# Altium project Jumperless_breadboard_REV1.PrjPcb (part 1 of 4)
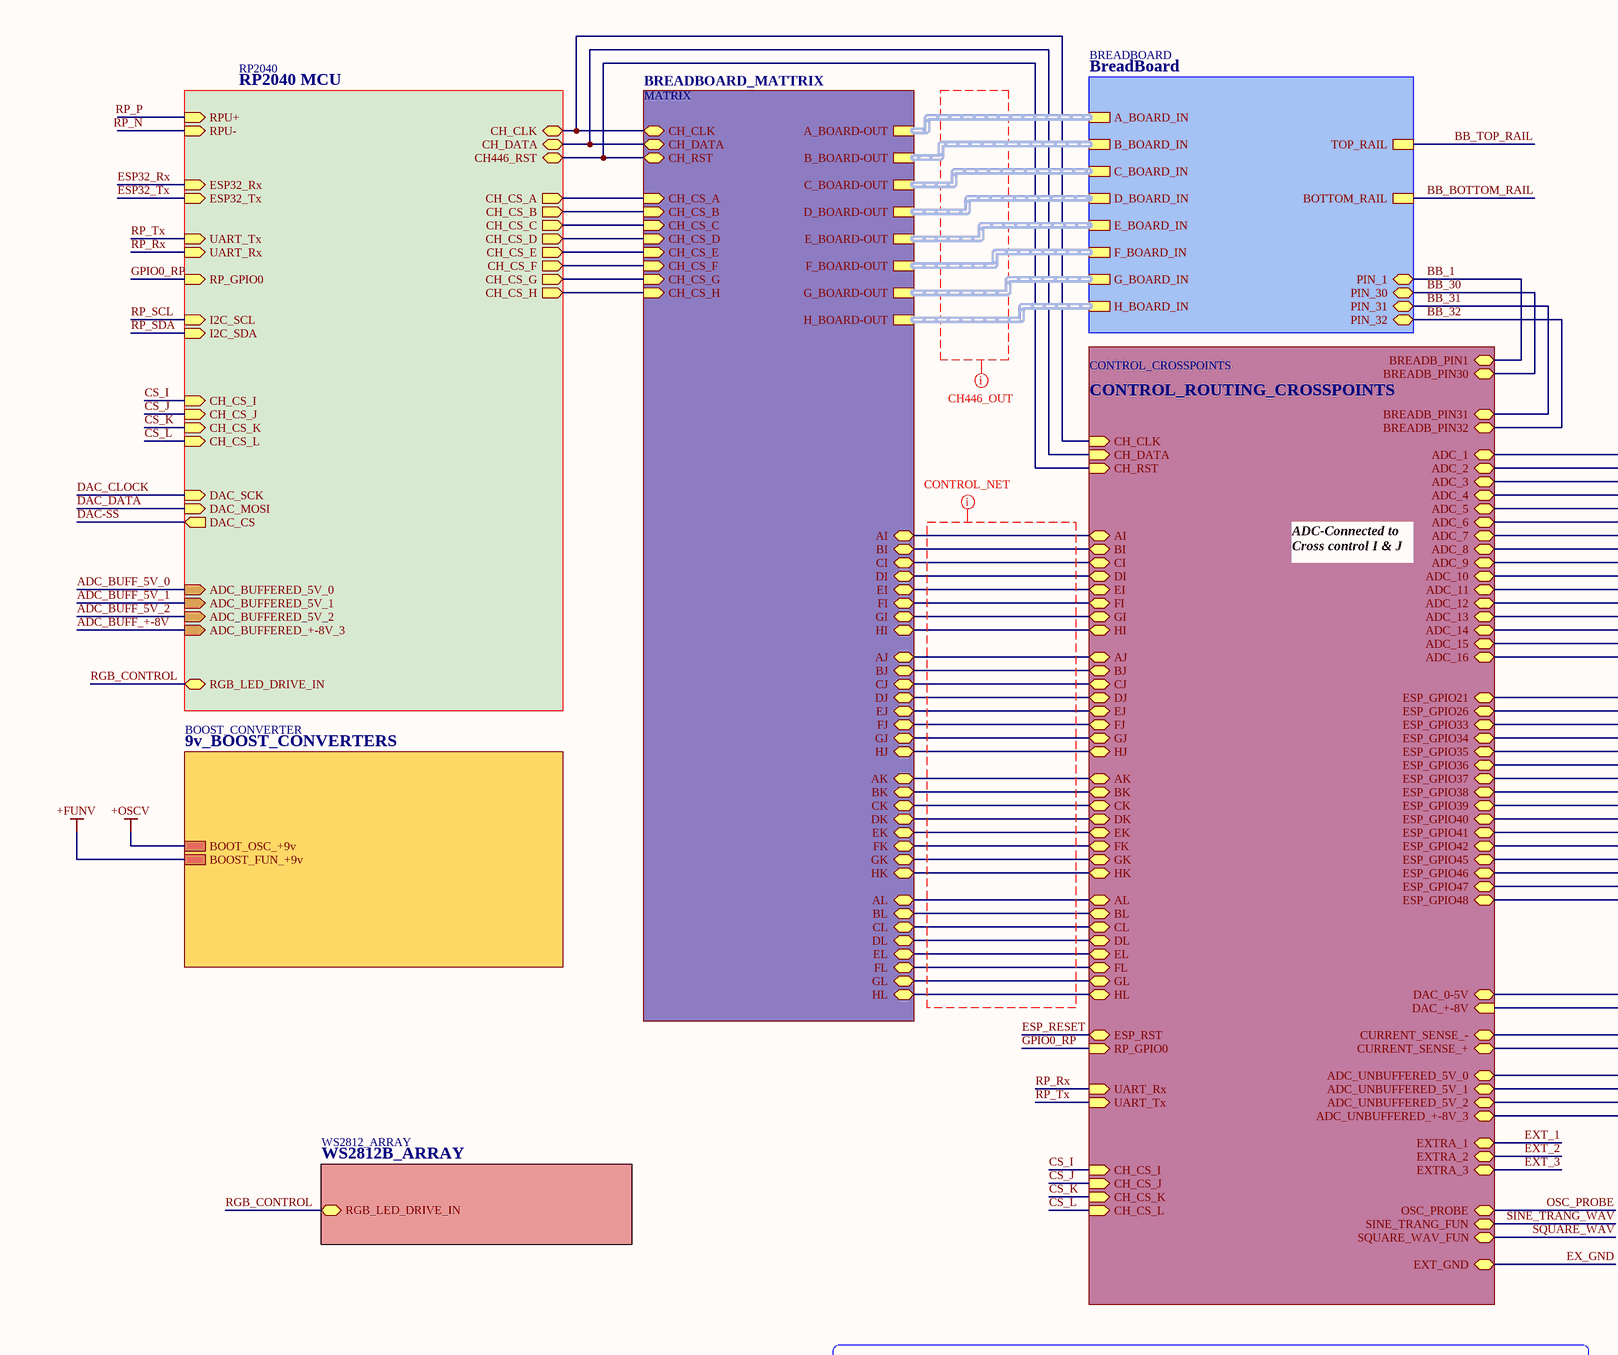
[diagram p0: Main.SchDoc, top left]
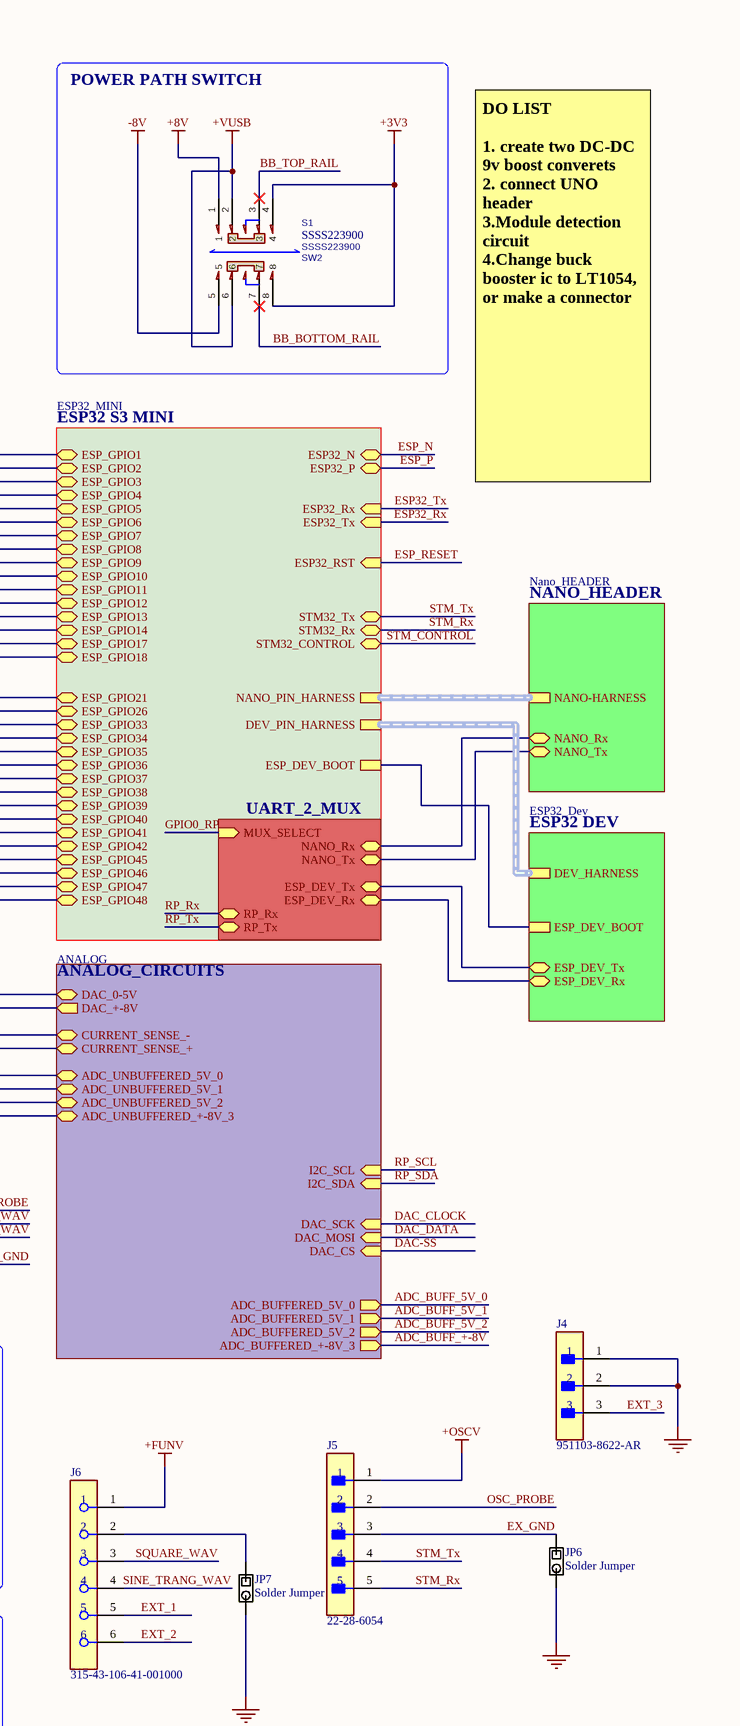
[diagram p1: Main.SchDoc, top right]
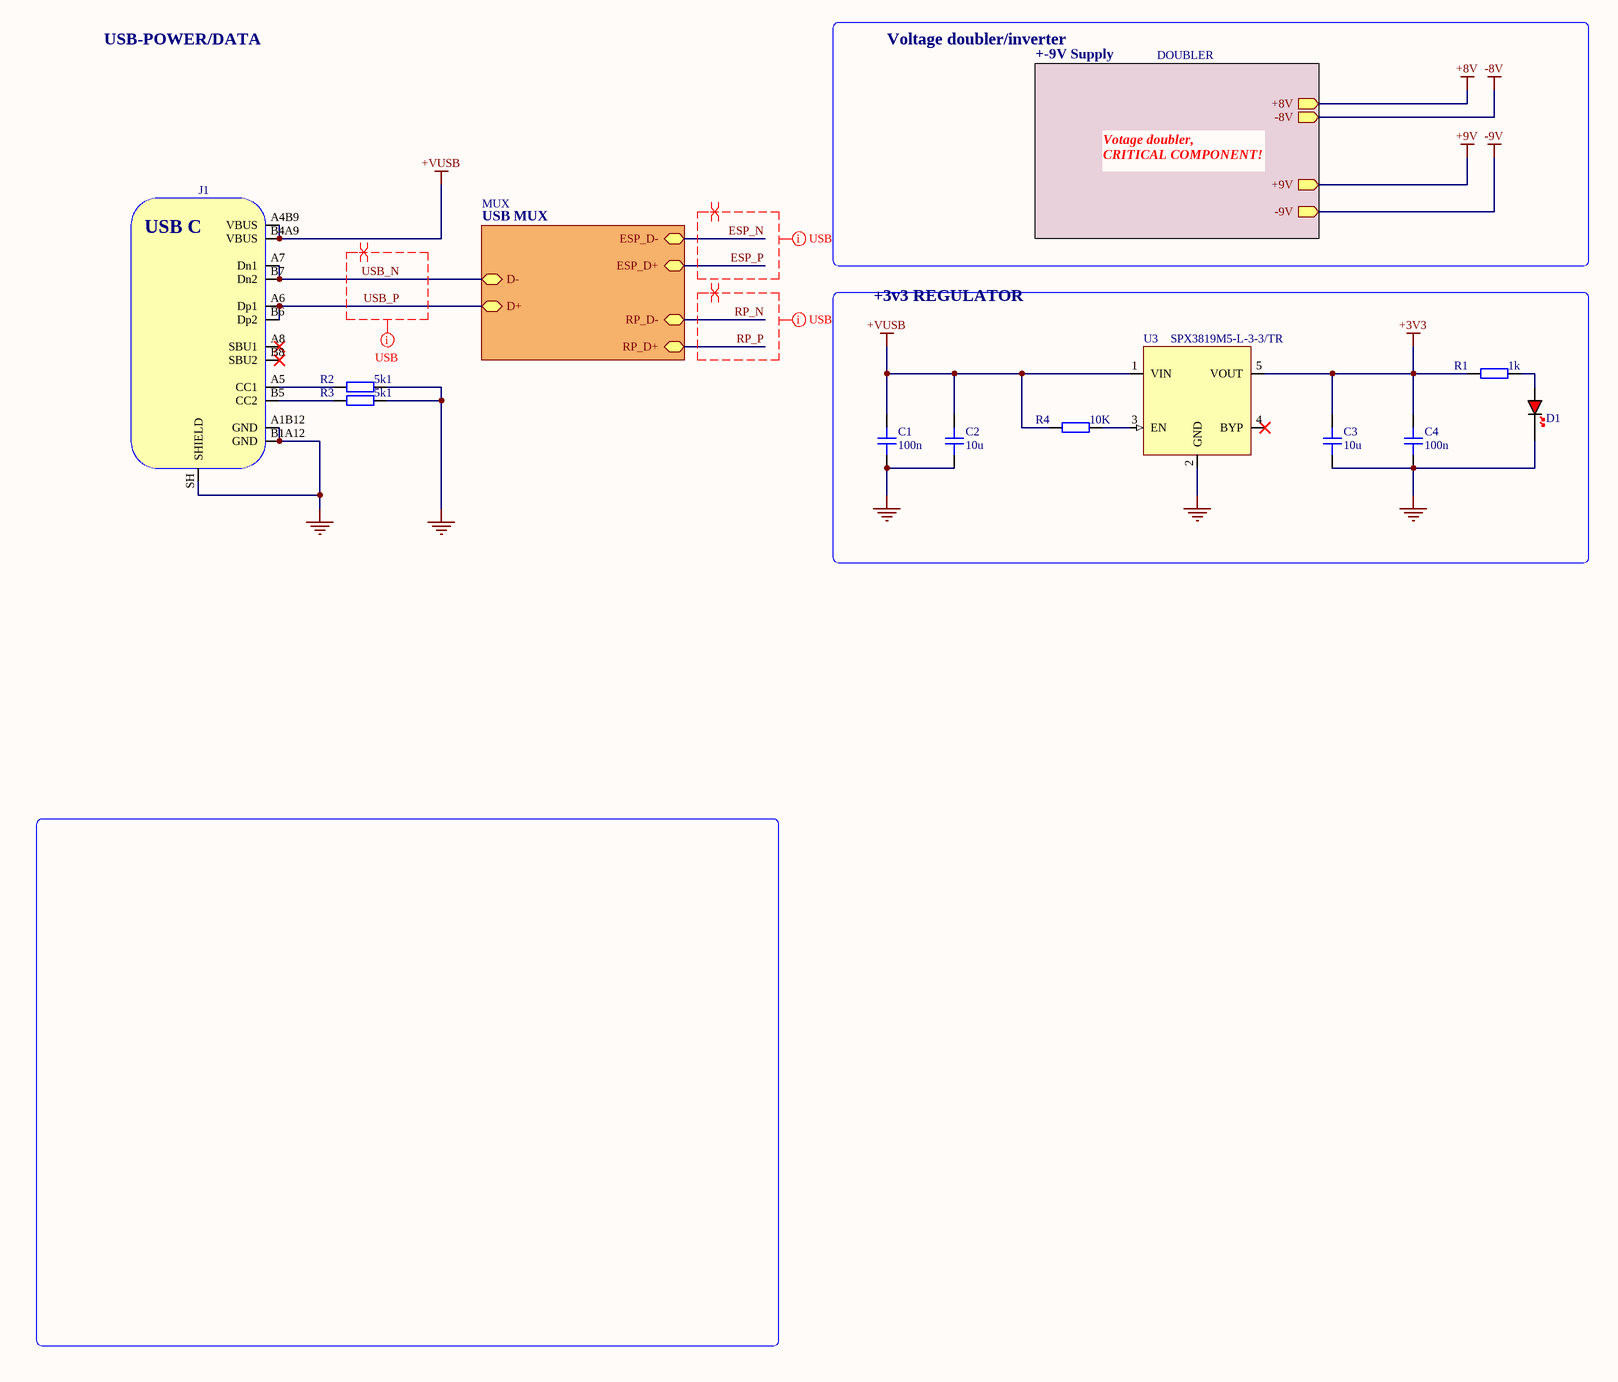
[diagram p2: Main.SchDoc, bottom left]
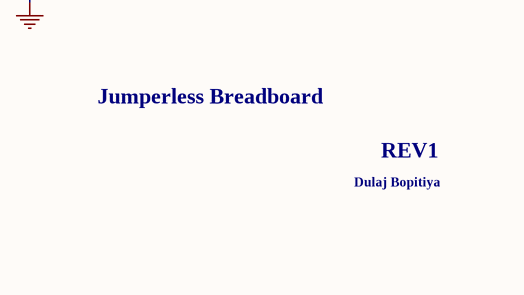
[diagram p3: Main.SchDoc, bottom right]
14 sheets, 615 parts. Net scope: hierarchical (ports join the sheet entries above them; power ports are global).
Board file: PCB1.PcbDoc
Sheets:
  Main.SchDoc
    MUX = USB MUX.SchDoc
    MATRIX = BREADBOARD_MATTRIX.SchDoc
    RP2040 = RP2040 MCU.SchDoc
    ESP32_MINI = ESP32 S3 MINI.SchDoc
    DOUBLER = +-9V Supply.SchDoc
    BREADBOARD = BreadBoard.SchDoc
    ANALOG = ANALOG_CIRCUITS.SchDoc
    CONTROL_CROSSPOINTS = CONTROL_ROUTING_CROSSPOINTS.SchDoc
    WS2812_ARRAY = WS2812B_ARRAY.SchDoc
    BOOST_CONVERTER = 9v_BOOST_CONVERTERS.SchDoc
    Nano_HEADER = NANO_HEADER.SchDoc
    ESP32_Dev = ESP32 DEV.SchDoc
    Designator = UART_2_MUX.SchDoc

## Sheet Main.SchDoc
size 430 x 369 mm; SheetNumber: 1; SheetTotal: 14

### Parts
C1  100n  [CAP_0805]
C2  10u  [CAP_0805]
C3  10u  [CAP_0805]
C4  100n  [CAP_0805]
D1  RED  [LED_0603_RED]  (value not drawn)
J1  B4105-GF-A-060  [USB4105-GF-A-060]  (value not drawn)
J4  951103-8622-AR  [FP-951103-8622-AR-MFG]
J5  22-28-6054  [FP-22-28-6054-MFG]
J6  315-43-106-41-001000  [FP-315-43-106-41-001000-MFG]
JP6  Solder Jumper  [SolderJumper_Single]
JP7  Solder Jumper  [SolderJumper_Single]
R1  1k  [RES_0603]
R2  5k1  [RES_0603]
R3  5k1  [RES_0603]
R4  10K  [RES_0603]
S1  SSSS223900  Reference: SW2  [SW-TH_SSSS223900]
U3  SPX3819M5-L-3-3/TR  [SOT-23-5]

### Blocks framed on the sheet
POWER PATH SWITCH: S1
+3v3 REGULATOR: C1-C4 D1 R1 R4 U3

### Sub-sheets
ANALOG = ANALOG_CIRCUITS: ADC_UNBUFFERED_5V_0 (bidir), ADC_BUFFERED_5V_0 (out), ADC_UNBUFFERED_5V_1 (bidir), ADC_BUFFERED_5V_1 (out), ADC_UNBUFFERED_5V_2 (bidir), ADC_BUFFERED_5V_2 (out), ADC_UNBUFFERED_+-8V_3 (bidir), ADC_BUFFERED_+-8V_3 (out), DAC_+-8V (out), DAC_MOSI (in), DAC_SCK (in), DAC_CS (in), I2C_SCL (in), I2C_SDA (in), CURRENT_SENSE_+ (bidir), CURRENT_SENSE_- (bidir), DAC_0-5V (bidir)
BOOST_CONVERTER = 9v_BOOST_CONVERTERS: BOOT_OSC_+9v, BOOST_FUN_+9v
BREADBOARD = BreadBoard: A_BOARD_IN (harness A_BOARD_H), B_BOARD_IN (harness B_BOARD_H), C_BOARD_IN (harness C_BOARD_H), D_BOARD_IN (harness D_BOARD_H), E_BOARD_IN (harness E_BOARD_H), F_BOARD_IN (harness F_BOARD_H), G_BOARD_IN (harness G_BOARD_H), H_BOARD_IN (harness H_BOARD_H), PIN_1 (bidir), PIN_31 (bidir), PIN_32 (bidir), PIN_30 (bidir), TOP_RAIL, BOTTOM_RAIL
CONTROL_CROSSPOINTS = CONTROL_ROUTING_CROSSPOINTS: CH_CLK (in), CH_DATA (in), CH_RST (in), AI (bidir), BI (bidir), CI (bidir), DI (bidir), EI (bidir), FI (bidir), GI (bidir), HI (bidir), AJ (bidir), BJ (bidir), CJ (bidir), DJ (bidir), EJ (bidir), FJ (bidir), GJ (bidir), HJ (bidir), AK (bidir), BK (bidir), CK (bidir), DK (bidir), EK (bidir), FK (bidir), GK (bidir), HK (bidir), AL (bidir), BL (bidir), CL (bidir), DL (bidir), EL (bidir), FL (bidir), GL (bidir), HL (bidir), CH_CS_I (in), CH_CS_J (in), CH_CS_K (in), CH_CS_L (in), ADC_1 (bidir), ADC_2 (bidir), ADC_3 (bidir), ADC_4 (bidir), ADC_5 (bidir), ADC_6 (bidir), ADC_7 (bidir), ADC_8 (bidir), ADC_9 (bidir), ADC_10 (bidir), ADC_11 (bidir), ADC_12 (bidir), ADC_13 (bidir), ADC_14 (bidir), ESP_GPIO21 (bidir), ESP_GPIO26 (bidir), ESP_GPIO33 (bidir), ESP_GPIO34 (bidir), ESP_GPIO35 (bidir), ESP_GPIO36 (bidir), ESP_GPIO37 (bidir), ESP_GPIO38 (bidir), ESP_GPIO39 (bidir), ESP_GPIO40 (bidir), ESP_GPIO48 (bidir), ESP_GPIO47 (bidir), ESP_GPIO41 (bidir), ESP_GPIO42 (bidir), ESP_GPIO45 (bidir), ESP_GPIO46 (bidir), ADC_15 (bidir), ADC_16 (bidir), DAC_0-5V (bidir), CURRENT_SENSE_- (bidir), CURRENT_SENSE_+ (bidir), ADC_UNBUFFERED_+-8V_3 (bidir), DAC_+-8V (in), ESP_RST (bidir), ADC_UNBUFFERED_5V_0 (bidir), ADC_UNBUFFERED_5V_1 (bidir), ADC_UNBUFFERED_5V_2 (bidir), BREADB_PIN1 (bidir), BREADB_PIN30 (bidir), BREADB_PIN32 (bidir), BREADB_PIN31 (bidir), RP_GPIO0 (in), UART_Rx (in), UART_Tx (in), OSC_PROBE (bidir), EXT_GND (bidir), SQUARE_WAV_FUN (bidir), SINE_TRANG_FUN (bidir), EXTRA_1 (bidir), EXTRA_2 (bidir), EXTRA_3 (bidir)
Designator = UART_2_MUX: MUX_SELECT (in), RP_Tx (bidir), RP_Rx (bidir), ESP_DEV_Rx (bidir), ESP_DEV_Tx (bidir), NANO_Rx (bidir), NANO_Tx (bidir)
DOUBLER = +-9V Supply: +9V (out), -9V (out), +8V (out), -8V (out)
ESP32_Dev = ESP32 DEV: ESP_DEV_BOOT, ESP_DEV_Tx (bidir), ESP_DEV_Rx (bidir), DEV_HARNESS (harness DEV_HARNESS)
ESP32_MINI = ESP32 S3 MINI: ESP32_N (bidir), ESP32_P (bidir), ESP32_Rx (in), ESP32_Tx (in), ESP_GPIO1 (bidir), ESP_GPIO2 (bidir), ESP_GPIO3 (bidir), ESP_GPIO4 (bidir), ESP_GPIO5 (bidir), ESP_GPIO6 (bidir), ESP_GPIO7 (bidir), ESP_GPIO8 (bidir), ESP_GPIO9 (bidir), ESP_GPIO10 (bidir), ESP_GPIO11 (bidir), ESP_GPIO12 (bidir), ESP_GPIO13 (bidir), ESP_GPIO14 (bidir), ESP_GPIO17 (bidir), ESP_GPIO18 (bidir), ESP_GPIO21 (bidir), ESP_GPIO26 (bidir), ESP_GPIO48 (bidir), ESP_GPIO47 (bidir), ESP_GPIO33 (bidir), ESP_GPIO34 (bidir), ESP_GPIO35 (bidir), ESP_GPIO36 (bidir), ESP_GPIO37 (bidir), ESP_GPIO38 (bidir), ESP_GPIO39 (bidir), ESP_GPIO40 (bidir), ESP_GPIO41 (bidir), ESP_GPIO42 (bidir), ESP_GPIO45 (bidir), ESP_GPIO46 (bidir), ESP32_RST (in), NANO_PIN_HARNESS (harness NANO-HARNESS), DEV_PIN_HARNESS (harness DEV_HARNESS), ESP_DEV_BOOT, STM32_Tx (bidir), STM32_Rx (bidir), STM32_CONTROL (bidir)
MATRIX = BREADBOARD_MATTRIX: B_BOARD-OUT (harness B_BOARD_H), C_BOARD-OUT (harness C_BOARD_H), D_BOARD-OUT (harness D_BOARD_H), E_BOARD-OUT (harness E_BOARD_H), F_BOARD-OUT (harness F_BOARD_H), G_BOARD-OUT (harness G_BOARD_H), H_BOARD-OUT (harness H_BOARD_H), A_BOARD-OUT (harness A_BOARD_H), AL (bidir), BL (bidir), CL (bidir), DL (bidir), EL (bidir), FL (bidir), GL (bidir), HL (bidir), CH_CLK (bidir), CH_DATA (bidir), CH_RST (bidir), CH_CS_A (in), CH_CS_B (in), CH_CS_C (in), CH_CS_D (in), CH_CS_E (in), CH_CS_F (in), CH_CS_G (in), CH_CS_H (in), AI (bidir), BI (bidir), CI (bidir), DI (bidir), EI (bidir), FI (bidir), GI (bidir), HI (bidir), AJ (bidir), BJ (bidir), CJ (bidir), DJ (bidir), EJ (bidir), FJ (bidir), GJ (bidir), HJ (bidir), AK (bidir), BK (bidir), CK (bidir), DK (bidir), EK (bidir), FK (bidir), GK (bidir), HK (bidir)
MUX = USB MUX: D+ (bidir), D- (bidir), ESP_D- (bidir), ESP_D+ (bidir), RP_D- (bidir), RP_D+ (bidir)
Nano_HEADER = NANO_HEADER: NANO-HARNESS (harness NANO-HARNESS), NANO_Rx (bidir), NANO_Tx (bidir)
RP2040 = RP2040 MCU: RPU+ (in), RPU- (in), DAC_MOSI (in), DAC_SCK (in), DAC_CS (out), I2C_SDA (in), I2C_SCL (in), ADC_BUFFERED_5V_0 (in), ADC_BUFFERED_5V_1 (in), ADC_BUFFERED_5V_2 (in), ADC_BUFFERED_+-8V_3 (in), ESP32_Rx (in), ESP32_Tx (in), UART_Rx (in), UART_Tx (in), CH_CS_A (out), CH_CS_B (out), CH_CS_C (out), CH_CS_D (out), CH_CS_E (out), CH_CS_F (out), CH_CS_G (out), CH_CS_H (out), CH_CLK (bidir), CH_DATA (bidir), RGB_LED_DRIVE_IN (bidir), CH446_RST (bidir), CH_CS_I (in), CH_CS_J (in), CH_CS_K (in), CH_CS_L (in), RP_GPIO0 (in)
WS2812_ARRAY = WS2812B_ARRAY: RGB_LED_DRIVE_IN (bidir)

### Nets
+3V3: C3.2 C4.2 R1.1 S1.4 S1.8 U3.5(VOUT)  [project net BUCK1_3v3]
+8V: S1.1 ; sheet DOUBLER/+8V
+FUNV: J6.1 ; sheet BOOST_CONVERTER/BOOST_FUN_+9v
+OSCV: J5.1 ; sheet BOOST_CONVERTER/BOOT_OSC_+9v
+VUSB: C1.2 C2.2 J1.A4B9(VBUS) J1.B4A9(VBUS) R4.1 S1.2 S1.6 U3.1(VIN)  [project net ANALOG_5V]
-8V: S1.5 ; sheet DOUBLER/-8V
GND: C1.1 C2.1 C3.1 C4.1 D1.K J1.A1B12(GND) J1.B1A12(GND) J1.SH(SHIELD) J4.1 J4.2 JP6.2 JP7.2 R2.2 R3.2 U3.2(GND)  [project net REF]
\: sheet ESP32_MINI/ESP_GPIO38, sheet CONTROL_CROSSPOINTS/ESP_GPIO38
A0: sheet ESP32_MINI/ESP_GPIO1, sheet CONTROL_CROSSPOINTS/ADC_1
A1: sheet ESP32_MINI/ESP_GPIO13, sheet CONTROL_CROSSPOINTS/ADC_13
A2: sheet ESP32_MINI/ESP_GPIO3, sheet CONTROL_CROSSPOINTS/ADC_3
A3: sheet ESP32_MINI/ESP_GPIO17, sheet CONTROL_CROSSPOINTS/ADC_15
A4: sheet ESP32_MINI/ESP_GPIO5, sheet CONTROL_CROSSPOINTS/ADC_5
A5: sheet ESP32_MINI/ESP_GPIO21, sheet CONTROL_CROSSPOINTS/ESP_GPIO21
A6: sheet ESP32_MINI/ESP_GPIO7, sheet CONTROL_CROSSPOINTS/ADC_7
A7: sheet ESP32_MINI/ESP_GPIO33, sheet CONTROL_CROSSPOINTS/ESP_GPIO33
ADC_BUFF_5V_0: sheet RP2040/ADC_BUFFERED_5V_0, sheet ANALOG/ADC_BUFFERED_5V_0
ADC_BUFF_5V_1: sheet RP2040/ADC_BUFFERED_5V_1, sheet ANALOG/ADC_BUFFERED_5V_1
ADC_BUFF_5V_2: sheet RP2040/ADC_BUFFERED_5V_2, sheet ANALOG/ADC_BUFFERED_5V_2
ADC_BUFF_+-8V: sheet RP2040/ADC_BUFFERED_+-8V_3, sheet ANALOG/ADC_BUFFERED_+-8V_3
AREF: sheet ESP32_MINI/ESP_GPIO37, sheet CONTROL_CROSSPOINTS/ESP_GPIO37
BB_1: sheet BREADBOARD/PIN_1, sheet CONTROL_CROSSPOINTS/BREADB_PIN1
BB_30: sheet BREADBOARD/PIN_30, sheet CONTROL_CROSSPOINTS/BREADB_PIN30
BB_31: sheet BREADBOARD/PIN_31, sheet CONTROL_CROSSPOINTS/BREADB_PIN31
BB_32: sheet BREADBOARD/PIN_32, sheet CONTROL_CROSSPOINTS/BREADB_PIN32
BB_BOTTOM_RAIL: S1.7 ; sheet BREADBOARD/BOTTOM_RAIL
BB_TOP_RAIL: S1.3 ; sheet BREADBOARD/TOP_RAIL
CH446_CLK: sheet MATRIX/CH_CLK, sheet RP2040/CH_CLK, sheet CONTROL_CROSSPOINTS/CH_CLK
CH446_CS_A: sheet MATRIX/CH_CS_A, sheet RP2040/CH_CS_A
CH446_CS_B: sheet MATRIX/CH_CS_B, sheet RP2040/CH_CS_B
CH446_CS_C: sheet MATRIX/CH_CS_C, sheet RP2040/CH_CS_C
CH446_CS_D: sheet MATRIX/CH_CS_D, sheet RP2040/CH_CS_D
CH446_CS_E: sheet MATRIX/CH_CS_E, sheet RP2040/CH_CS_E
CH446_CS_F: sheet MATRIX/CH_CS_F, sheet RP2040/CH_CS_F
CH446_CS_G: sheet MATRIX/CH_CS_G, sheet RP2040/CH_CS_G
CH446_CS_H: sheet MATRIX/CH_CS_H, sheet RP2040/CH_CS_H
CH446_DATA: sheet MATRIX/CH_DATA, sheet RP2040/CH_DATA, sheet CONTROL_CROSSPOINTS/CH_DATA
CH446_RESET: sheet MATRIX/CH_RST, sheet RP2040/CH446_RST, sheet CONTROL_CROSSPOINTS/CH_RST
CROSS_AI: sheet MATRIX/AI, sheet CONTROL_CROSSPOINTS/AI
CROSS_AJ: sheet MATRIX/AJ, sheet CONTROL_CROSSPOINTS/AJ
CROSS_AK: sheet MATRIX/AK, sheet CONTROL_CROSSPOINTS/AK
CROSS_AL: sheet MATRIX/AL, sheet CONTROL_CROSSPOINTS/AL
CROSS_BI: sheet MATRIX/BI, sheet CONTROL_CROSSPOINTS/BI
CROSS_BJ: sheet MATRIX/BJ, sheet CONTROL_CROSSPOINTS/BJ
CROSS_BK: sheet MATRIX/BK, sheet CONTROL_CROSSPOINTS/BK
CROSS_BL: sheet MATRIX/BL, sheet CONTROL_CROSSPOINTS/BL
CROSS_CI: sheet MATRIX/CI, sheet CONTROL_CROSSPOINTS/CI
CROSS_CJ: sheet MATRIX/CJ, sheet CONTROL_CROSSPOINTS/CJ
CROSS_CK: sheet MATRIX/CK, sheet CONTROL_CROSSPOINTS/CK
CROSS_CL: sheet MATRIX/CL, sheet CONTROL_CROSSPOINTS/CL
CROSS_DI: sheet MATRIX/DI, sheet CONTROL_CROSSPOINTS/DI
CROSS_DJ: sheet MATRIX/DJ, sheet CONTROL_CROSSPOINTS/DJ
CROSS_DK: sheet MATRIX/DK, sheet CONTROL_CROSSPOINTS/DK
CROSS_DL: sheet MATRIX/DL, sheet CONTROL_CROSSPOINTS/DL
CROSS_EI: sheet MATRIX/EI, sheet CONTROL_CROSSPOINTS/EI
CROSS_EJ: sheet MATRIX/EJ, sheet CONTROL_CROSSPOINTS/EJ
CROSS_EK: sheet MATRIX/EK, sheet CONTROL_CROSSPOINTS/EK
CROSS_EL: sheet MATRIX/EL, sheet CONTROL_CROSSPOINTS/EL
CROSS_FI: sheet MATRIX/FI, sheet CONTROL_CROSSPOINTS/FI
CROSS_FJ: sheet MATRIX/FJ, sheet CONTROL_CROSSPOINTS/FJ
CROSS_FK: sheet MATRIX/FK, sheet CONTROL_CROSSPOINTS/FK
CROSS_FL: sheet MATRIX/FL, sheet CONTROL_CROSSPOINTS/FL
CROSS_GI: sheet MATRIX/GI, sheet CONTROL_CROSSPOINTS/GI
CROSS_GJ: sheet MATRIX/GJ, sheet CONTROL_CROSSPOINTS/GJ
CROSS_GK: sheet MATRIX/GK, sheet CONTROL_CROSSPOINTS/GK
CROSS_GL: sheet MATRIX/GL, sheet CONTROL_CROSSPOINTS/GL
CROSS_HI: sheet MATRIX/HI, sheet CONTROL_CROSSPOINTS/HI
CROSS_HJ: sheet MATRIX/HJ, sheet CONTROL_CROSSPOINTS/HJ
CROSS_HK: sheet MATRIX/HK, sheet CONTROL_CROSSPOINTS/HK
CROSS_HL: sheet MATRIX/HL, sheet CONTROL_CROSSPOINTS/HL
CS_I: sheet RP2040/CH_CS_I, sheet CONTROL_CROSSPOINTS/CH_CS_I  [project net CH446_CS_I]
CS_J: sheet RP2040/CH_CS_J, sheet CONTROL_CROSSPOINTS/CH_CS_J  [project net CH446_CS_J]
CS_K: sheet RP2040/CH_CS_K, sheet CONTROL_CROSSPOINTS/CH_CS_K  [project net CH446_CS_K]
CS_L: sheet RP2040/CH_CS_L, sheet CONTROL_CROSSPOINTS/CH_CS_L  [project net CH446_CS_L]
CURR_SENSE_DAC_-: sheet ANALOG/DAC_0-5V, sheet CONTROL_CROSSPOINTS/DAC_0-5V
D0: sheet ESP32_MINI/ESP_GPIO12, sheet CONTROL_CROSSPOINTS/ADC_12, sheet Nano_HEADER/NANO_Rx, sheet Designator/NANO_Rx
D1: sheet ESP32_MINI/ESP_GPIO2, sheet CONTROL_CROSSPOINTS/ADC_2, sheet Nano_HEADER/NANO_Tx, sheet Designator/NANO_Tx
D2: sheet ESP32_MINI/ESP_GPIO14, sheet CONTROL_CROSSPOINTS/ADC_14
D3: sheet ESP32_MINI/ESP_GPIO4, sheet CONTROL_CROSSPOINTS/ADC_4
D4: sheet ESP32_MINI/ESP_GPIO18, sheet CONTROL_CROSSPOINTS/ADC_16
D5: sheet ESP32_MINI/ESP_GPIO6, sheet CONTROL_CROSSPOINTS/ADC_6
D6: sheet ESP32_MINI/ESP_GPIO26, sheet CONTROL_CROSSPOINTS/ESP_GPIO26
D7: sheet ESP32_MINI/ESP_GPIO8, sheet CONTROL_CROSSPOINTS/ADC_8
D8: sheet ESP32_MINI/ESP_GPIO34, sheet CONTROL_CROSSPOINTS/ESP_GPIO34
D9: sheet ESP32_MINI/ESP_GPIO10, sheet CONTROL_CROSSPOINTS/ADC_10
D10: sheet ESP32_MINI/ESP_GPIO35, sheet CONTROL_CROSSPOINTS/ESP_GPIO35
D11: sheet ESP32_MINI/ESP_GPIO9, sheet CONTROL_CROSSPOINTS/ADC_9
D12: sheet ESP32_MINI/ESP_GPIO36, sheet CONTROL_CROSSPOINTS/ESP_GPIO36
D13: sheet ESP32_MINI/ESP_GPIO11, sheet CONTROL_CROSSPOINTS/ADC_11
DAC-SS: sheet RP2040/DAC_CS, sheet ANALOG/DAC_CS
DAC_CLOCK: sheet RP2040/DAC_SCK, sheet ANALOG/DAC_SCK
DAC_DATA: sheet RP2040/DAC_MOSI, sheet ANALOG/DAC_MOSI
DEV_BOOT: sheet ESP32_MINI/ESP_GPIO47, sheet ESP32_MINI/ESP_DEV_BOOT, sheet CONTROL_CROSSPOINTS/ESP_GPIO47, sheet ESP32_Dev/ESP_DEV_BOOT
DEV_RESET: sheet ESP32_MINI/ESP_GPIO48, sheet CONTROL_CROSSPOINTS/ESP_GPIO48
ESP32_Rx: sheet RP2040/ESP32_Rx, sheet ESP32_MINI/ESP32_Tx
ESP32_Tx: sheet RP2040/ESP32_Tx, sheet ESP32_MINI/ESP32_Rx
ESP_N: sheet MUX/ESP_D-, sheet ESP32_MINI/ESP32_N
ESP_P: sheet MUX/ESP_D+, sheet ESP32_MINI/ESP32_P
ESP_RESET: sheet ESP32_MINI/ESP32_RST, sheet CONTROL_CROSSPOINTS/ESP_RST
EX_GND: J5.3 JP6.1 ; sheet CONTROL_CROSSPOINTS/EXT_GND
EXT_1: J6.5 ; sheet CONTROL_CROSSPOINTS/EXTRA_1
EXT_2: J6.6 ; sheet CONTROL_CROSSPOINTS/EXTRA_2
EXT_3: J4.3 ; sheet CONTROL_CROSSPOINTS/EXTRA_3
GPIO0_RP: sheet RP2040/RP_GPIO0, sheet CONTROL_CROSSPOINTS/RP_GPIO0, sheet Designator/MUX_SELECT
GPIO39: sheet ESP32_MINI/ESP_GPIO39, sheet CONTROL_CROSSPOINTS/ESP_GPIO39
GPIO40: sheet ESP32_MINI/ESP_GPIO40, sheet CONTROL_CROSSPOINTS/ESP_GPIO40
GPIO41: sheet ESP32_MINI/ESP_GPIO41, sheet CONTROL_CROSSPOINTS/ESP_GPIO41
OSC_PROBE: J5.2 ; sheet CONTROL_CROSSPOINTS/OSC_PROBE
RGB_CONTROL: sheet RP2040/RGB_LED_DRIVE_IN, sheet WS2812_ARRAY/RGB_LED_DRIVE_IN
RP_N: sheet MUX/RP_D-, sheet RP2040/RPU-
RP_P: sheet MUX/RP_D+, sheet RP2040/RPU+
RP_Rx: sheet RP2040/UART_Rx, sheet CONTROL_CROSSPOINTS/UART_Rx, sheet Designator/RP_Rx  [project net CROSS_Rx]
RP_SCL: sheet RP2040/I2C_SCL, sheet ANALOG/I2C_SCL  [project net CURRENT_SCL]
RP_SDA: sheet RP2040/I2C_SDA, sheet ANALOG/I2C_SDA  [project net CURRENT_SDA]
RP_Tx: sheet RP2040/UART_Tx, sheet CONTROL_CROSSPOINTS/UART_Tx, sheet Designator/RP_Tx  [project net CROSS_Tx]
SINE_TRANG_WAV: J6.4 ; sheet CONTROL_CROSSPOINTS/SINE_TRANG_FUN
SQUARE_WAV: J6.3 ; sheet CONTROL_CROSSPOINTS/SQUARE_WAV_FUN
STM_CONTROL: sheet ESP32_MINI/ESP_GPIO42, sheet ESP32_MINI/STM32_CONTROL, sheet CONTROL_CROSSPOINTS/ESP_GPIO42  [project net GPIO42]
STM_Rx: J5.5 ; sheet ESP32_MINI/ESP_GPIO45, sheet ESP32_MINI/STM32_Rx, sheet CONTROL_CROSSPOINTS/ESP_GPIO45  [project net GPIO45]
STM_Tx: J5.4 ; sheet ESP32_MINI/ESP_GPIO46, sheet ESP32_MINI/STM32_Tx, sheet CONTROL_CROSSPOINTS/ESP_GPIO46  [project net GPIO46]
USB_N: J1.A7(Dn1) J1.B7(Dn2) ; sheet MUX/D-
USB_P: J1.A6(Dp1) J1.B6(Dp2) ; sheet MUX/D+
Net*_8: sheet ESP32_Dev/ESP_DEV_Tx, sheet Designator/ESP_DEV_Tx
Net*_10: sheet ESP32_Dev/ESP_DEV_Rx, sheet Designator/ESP_DEV_Rx
NetC51_2: sheet ANALOG/DAC_+-8V, sheet CONTROL_CROSSPOINTS/DAC_+-8V
NetD1_A: D1.A R1.2
NetJ1_A5: J1.A5(CC1) R2.1
NetJ1_B5: J1.B5(CC2) R3.1
NetJ6_2: J6.2 JP7.1
NetR4_2: R4.2 U3.3(EN)
NetR18_1: sheet ANALOG/CURRENT_SENSE_-, sheet CONTROL_CROSSPOINTS/CURRENT_SENSE_-
NetR18_2: sheet ANALOG/CURRENT_SENSE_+, sheet CONTROL_CROSSPOINTS/CURRENT_SENSE_+
NetU18_3: sheet ANALOG/ADC_UNBUFFERED_5V_0, sheet CONTROL_CROSSPOINTS/ADC_UNBUFFERED_5V_0
NetU18_5: sheet ANALOG/ADC_UNBUFFERED_+-8V_3, sheet CONTROL_CROSSPOINTS/ADC_UNBUFFERED_+-8V_3
NetU18_10: sheet ANALOG/ADC_UNBUFFERED_5V_1, sheet CONTROL_CROSSPOINTS/ADC_UNBUFFERED_5V_1
NetU18_12: sheet ANALOG/ADC_UNBUFFERED_5V_2, sheet CONTROL_CROSSPOINTS/ADC_UNBUFFERED_5V_2

Not connected (* = marked no-connect by the designer): J1 A8(SBU1)* B8(SBU2)*; U3 4(BYP)*

### Buses and harness runs
harness sheet BREADBOARD/A_BOARD_IN = sheet MATRIX/A_BOARD-OUT
harness sheet BREADBOARD/B_BOARD_IN = sheet MATRIX/B_BOARD-OUT
harness sheet BREADBOARD/C_BOARD_IN = sheet MATRIX/C_BOARD-OUT
harness sheet BREADBOARD/D_BOARD_IN = sheet MATRIX/D_BOARD-OUT
harness sheet BREADBOARD/E_BOARD_IN = sheet MATRIX/E_BOARD-OUT
harness sheet BREADBOARD/F_BOARD_IN = sheet MATRIX/F_BOARD-OUT
harness sheet BREADBOARD/G_BOARD_IN = sheet MATRIX/G_BOARD-OUT
harness sheet BREADBOARD/H_BOARD_IN = sheet MATRIX/H_BOARD-OUT
harness sheet ESP32_Dev/DEV_HARNESS = sheet ESP32_MINI/DEV_PIN_HARNESS
harness sheet ESP32_MINI/NANO_PIN_HARNESS = sheet Nano_HEADER/NANO-HARNESS

### Layout directives
mark named CH446_OUT: (no net found under the mark)
differential pair: ESP_N, ESP_P, RP_N, RP_P, USB_N, USB_P
mark named USB: ESP_N, ESP_P, RP_N, RP_P, USB_N, USB_P
mark named CONTROL_NET: (no net found under the mark)

### Notes on the sheet
- DO LIST
  1. create two DC-DC 9v boost converets
  2. connect UNO header
  3.Module detection circuit
  4.Change buck booster ic to LT1054, or make a connector
- ADC-Connected to Cross control I & J
- USB-POWER/DATA
- Voltage doubler/inverter
- Votage doubler,
  CRITICAL COMPONENT!
- Jumperless Breadboard
- REV1
- Dulaj Bopitiya
- (in symbol USB4105-GF-A-060) USB C

### Library data of the parts
C1-C4 = CAP_0805: Capacitor SMD 0805; Manufacturer: *; Manufacturer Part Number: *; Distributor Link: *; LCSC: *; Rating: *; Dielectric: *
D1 = LED_0603_RED: LED 0603 RED SMD
J1 = USB4105-GF-A-060: USB Connector Type C SMT 12 Pin; Manufacturer: GCT; Manufacturer Part Number: USB4105-GF-A-060; Distributor Link: https://eu.mouser.com/ProductDetail/GCT/USB4105-GF-A-060?qs=QNEnbhJQKvY2mocwNJzgfA%3D%3D
J4 = CMP-05379-000003-1: CONN HEADER VERT 3POS 2MM; Manufacturer: 3M; Conn Gender: Male; Current Rating: 2A; Number Of Contacts: 3; Conn Orientation: Straight; Digikey Description: CONN HEADER VERT 3POS 2MM; Device Class L3: unset; Category: Conn; Height: 6.3mm; Manufacturer Part Number: 951103-8622-AR; RoHS: TRUE; Contact Material: Gold,Nickel; ComponentLink2Description: Datasheet; Temperature Range Low: -55°C; Device Class L1: Connectors; Pitch: 2mm; Mouser Description: Header; PinStrip; CopperAlloy; HighTempThermoplastic; 3Cnts; 1A; RtAngle; 951Series; Octopart: https://octopart.com/951103-8622-ar-3m-14400669; Package: 951103-8622-AR; Lead Free: Yes; Device Class L2: Headers and Wire Housings; Temperature Range High: +125°C; ComponentLink2URL: http://multimedia.3m.com/mws/media/1400506O/3m-pin-strip-header-951-series-78-5100-2653-3.pdf; Automotive: No; Temperature: -55°C to +125°C; Number Of Rows: 1
J5 = CMP-04776-001058-1: KK 100 HDR ASSY RA BKWY 05 CKT 3; Number of Positions: 5; Current Rating: 4A; Contact Resistance: 20mR; Gender: Male; Pitch: 2.54mm; Voltage Rating: 250V; Glow Wire Compliant: Non-compliant; Min Operating Temperature: 0°C; Number of Circuits: 5; Number of Rows: 1; Termination: Solder; Orientation: Right Angle; ELV: Compliant; Package Quantity: 1500; Contact Plating: Gold; RoHS Compliant: Yes; Max Operating Temperature: 75°C; Number of Contacts: 5; Mount: Through Hole; Packaging: Bulk; Series: 42376; Flammability Rating: UL94 V-0
J6 = CMP-00254-12081839-1: 315-43-106-41-001000 IC & Component Sockets Interconnect Socket; Number of Positions: 6; Pitch: 2.54mm; Connector Type: Receptacle, Socket; Contact Plating: Gold; NexarPartId: 12081839; Mount: Through Hole; RoHS: Compliant; Termination: Solder; Packaging: Bulk; Color: Black; Number of Rows: 1
JP6 JP7 = SolderJumper_Single: Solder Jumper Single 0.5mm Pitch
R1-R4 = RES_0603: Resistor SMD 0603; Manufacturer: *; Manufacturer Part Number: *; Distributor Link: *; LCSC: *
U3 = SPX3819M5-L-3-3/TR: 500mA +3.3V Low-Noise LDO Voltage Regulator; Manufacturer: MaxLinear; Manufacturer Part Number: SPX3819M5-L-3-3/TR
S1 = SSSS223900: Footprint: easyeda2kicad:SW-TH_SSSS223900; Datasheet: https://lcsc.com/product-detail/Toggle-Switches_ALPS_SSSS223900_SSSS223900_C160874.html; LCSC Part: C160874; Value: SSSS223900

## Sheet USB MUX.SchDoc
size A; SheetNumber: 2; SheetTotal: 14
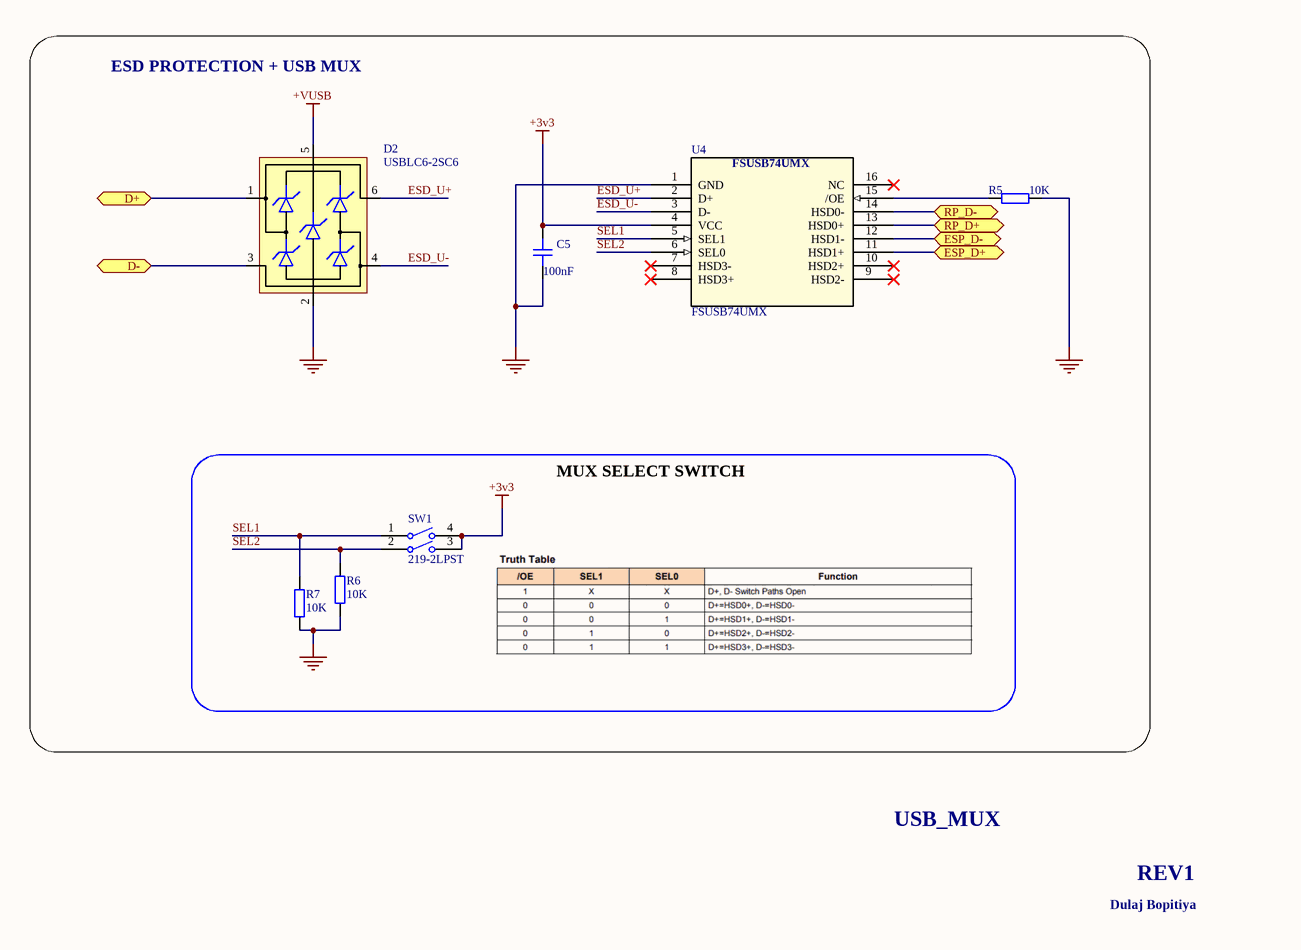
[diagram p4: USB MUX.SchDoc, left]

### Parts
C5  100nF  [CAP_0603]
D2  USBLC6-2SC6  [SOT-23-6]
R5  10K  [RES_0603]
R6  10K  [RES_0603]
R7  10K  [RES_0603]
SW1  219-2LPST  [CTS-219-2LPST_V]
U4  FSUSB74UMX  [UMLP16_1P8X2P6_ONS]

### Blocks framed on the sheet
ESD PROTECTION + USB MUX: C5 D2 R5 U4
MUX SELECT SWITCH: R6 R7 SW1

### Ports
D+ (bidir), D- (bidir), ESP_D+ (bidir), ESP_D- (bidir), RP_D+ (bidir), RP_D- (bidir)

### Nets
+3v3: C5.2 SW1.3 SW1.4 U4.4(VCC)  [project net BUCK1_3v3]
+VUSB: D2.5(VBUS)  [project net ANALOG_5V]
GND: C5.1 D2.2(GND) R5.1 R6.1 R7.1 U4.1(GND)  [project net REF]
ESD_U+: D2.6(IO1) U4.2(D+)  [project net ESD_U+_2]
ESD_U-: D2.4(IO2) U4.3(D-)  [project net ESD_U-_2]
ESP_N: U4.12(HSD1-) ; port ESP_D-
ESP_P: U4.11(HSD1+) ; port ESP_D+
RP_N: U4.14(HSD0-) ; port RP_D-
RP_P: U4.13(HSD0+) ; port RP_D+
SEL1: R7.2 SW1.1 U4.5(SEL1)  [project net SEL1_2]
SEL2: R6.2 SW1.2 U4.6(SEL0)  [project net SEL2_2]
USB_N: D2.3(IO2) ; port D-
USB_P: D2.1(IO1) ; port D+
NetR5_2: R5.2 U4.15(/OE)

Not connected (* = marked no-connect by the designer): U4 7(HSD3-)* 8(HSD3+)* 9(HSD2-)* 10(HSD2+)* 16(NC)*

### Notes on the sheet
- USB_MUX
- REV1
- Dulaj Bopitiya

### Library data of the parts
C5 = CAP_0603: Capacitor SMD 0603; Manufacturer: *; Manufacturer Part Number: *; Distributor Link: *; LCSC: *; Rating: *; Dielectric: *
D2 = USBLC6-2SC6: Low-Capacitance ESD Protection USB; Manufacturer: STMicroelectronics; Manufacturer Part Number: USBLC6-2SC6; Distributor Link: https://www.mouser.de/ProductDetail/STMicroelectronics/USBLC6-2SC6?qs=po45yt2pPpu%2FhNIlwQdTlg%3D%3D
R5-R7 = RES_0603: Resistor SMD 0603; Manufacturer: *; Manufacturer Part Number: *; Distributor Link: *; LCSC: *
SW1 = CMP-2000-05532-1: Surface Mount DIP Switch Auto Placeable, -55 to 85 degC, 4-Pin SMD, RoHS, Tube; Manufacturer: CTS Corporation; Sealed Option: Sealed; Circuitry: SPST; No of Positions: 2; Actuator Style: LowProfile; Type: Dip; Package Reference: 219-2LPST; Mounting Technology: SurfaceMount; Datasheet Version: 12/2008; Package Description: 4-Pin Surface Mount Device, Body 6.7 x 6.55 mm; Datasheet URL: http://www.ctscorp.com/wp-content/uploads/2016/01/219-Dec-30-2008.pdf; Termination Style: GullWing; Manufacturer URL: http://www.ctscorp.com/
U4 = FSUSB74UMX: No Description Available; Manufacturer_Name: onsemi; Copyright: Copyright (C) 2025 Ultra Librarian. All rights reserved.; Manufacturer_Part_Number: FSUSB74UMX; RefDes: RefDes; Type: Type

## Sheet BREADBOARD_MATTRIX.SchDoc
size A2; SheetNumber: 3; SheetTotal: 15
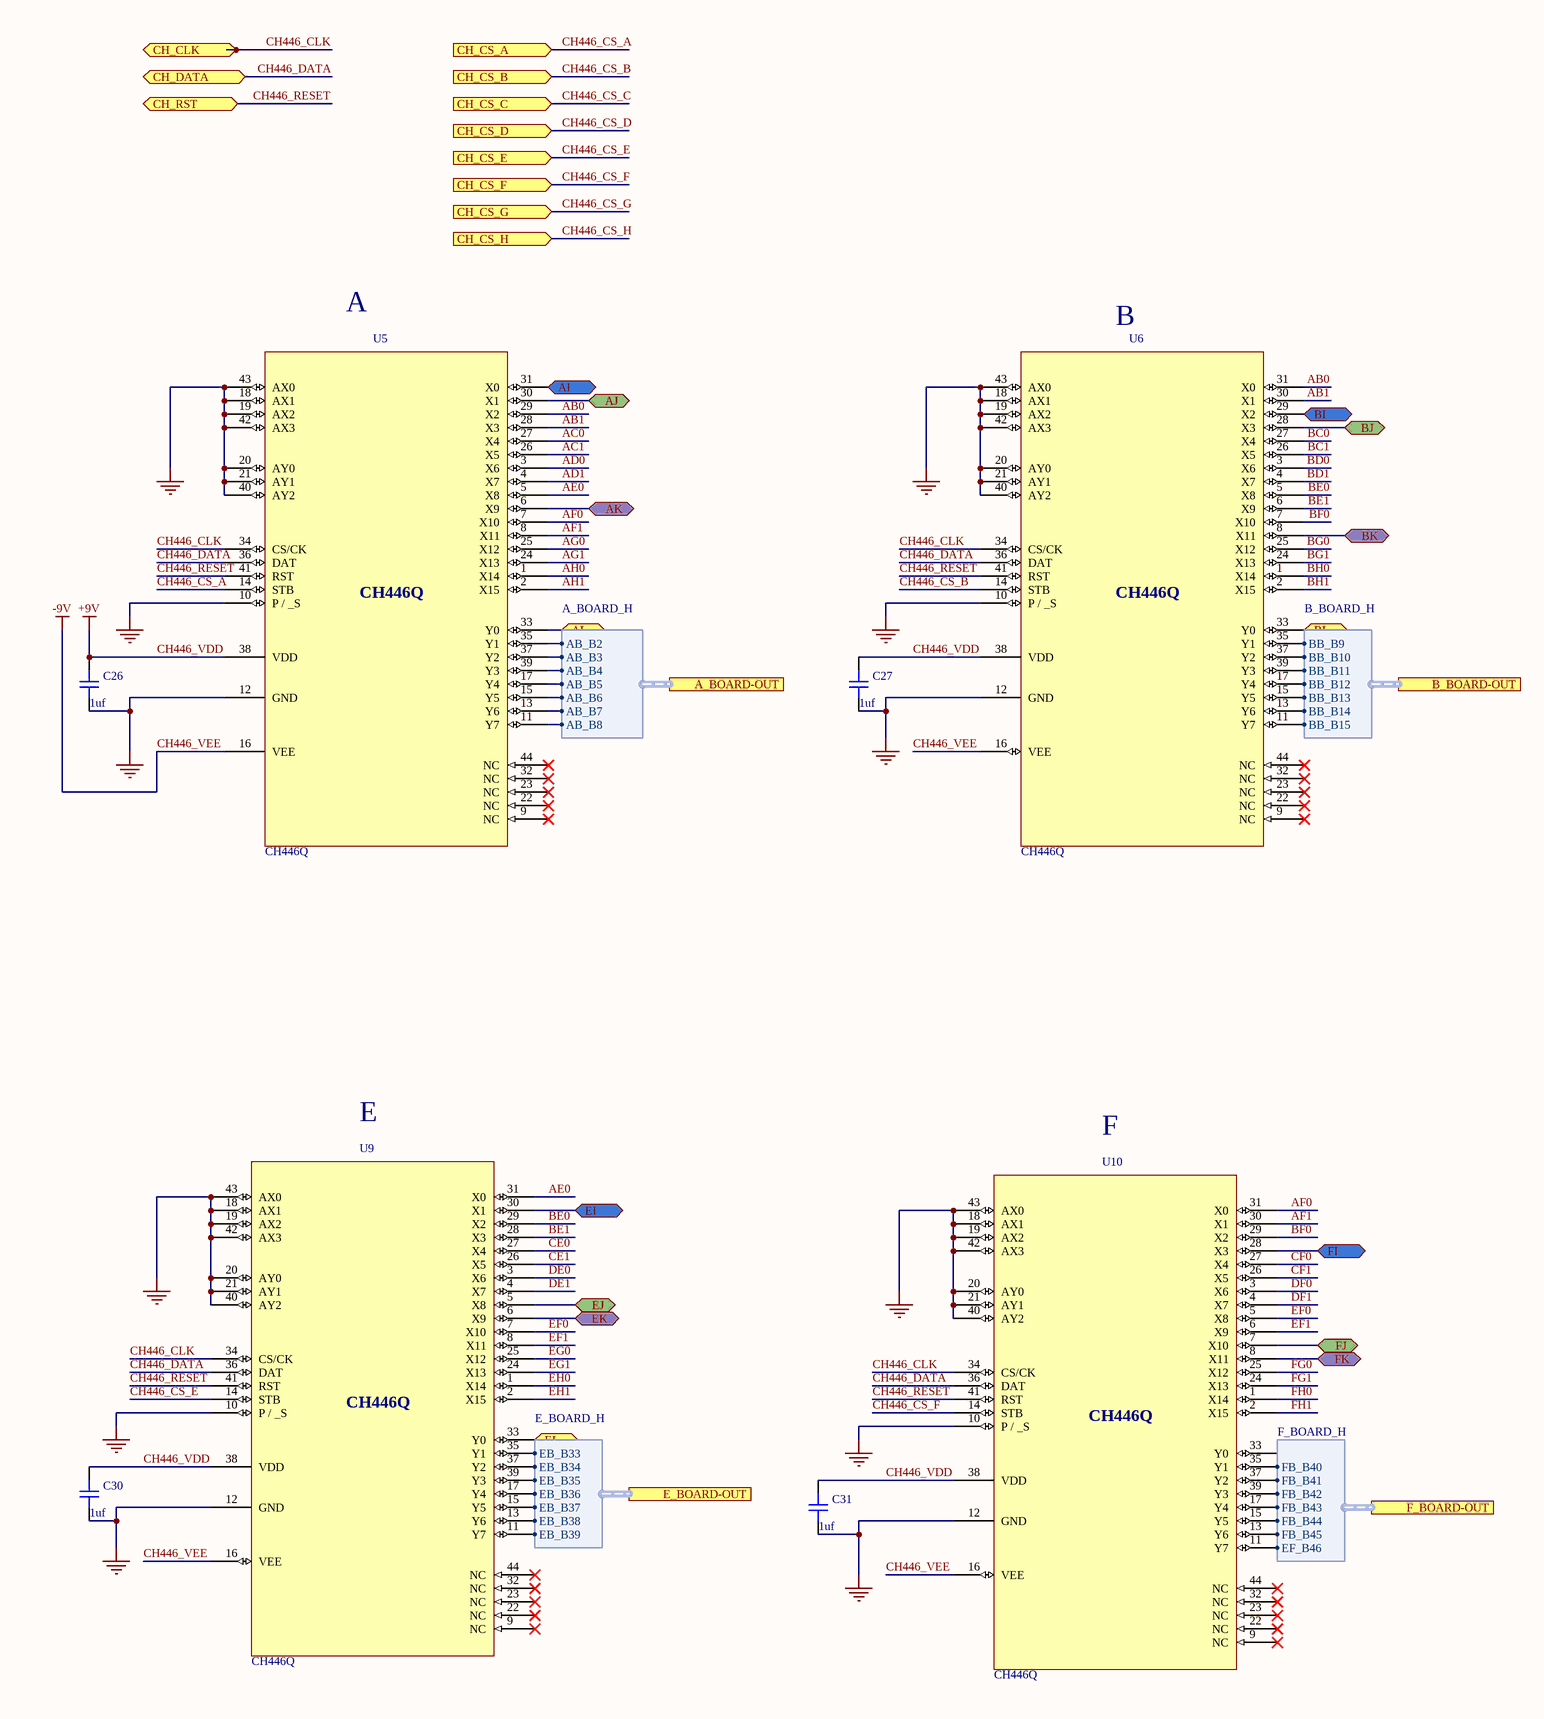
[diagram p5: BREADBOARD_MATTRIX.SchDoc, left]
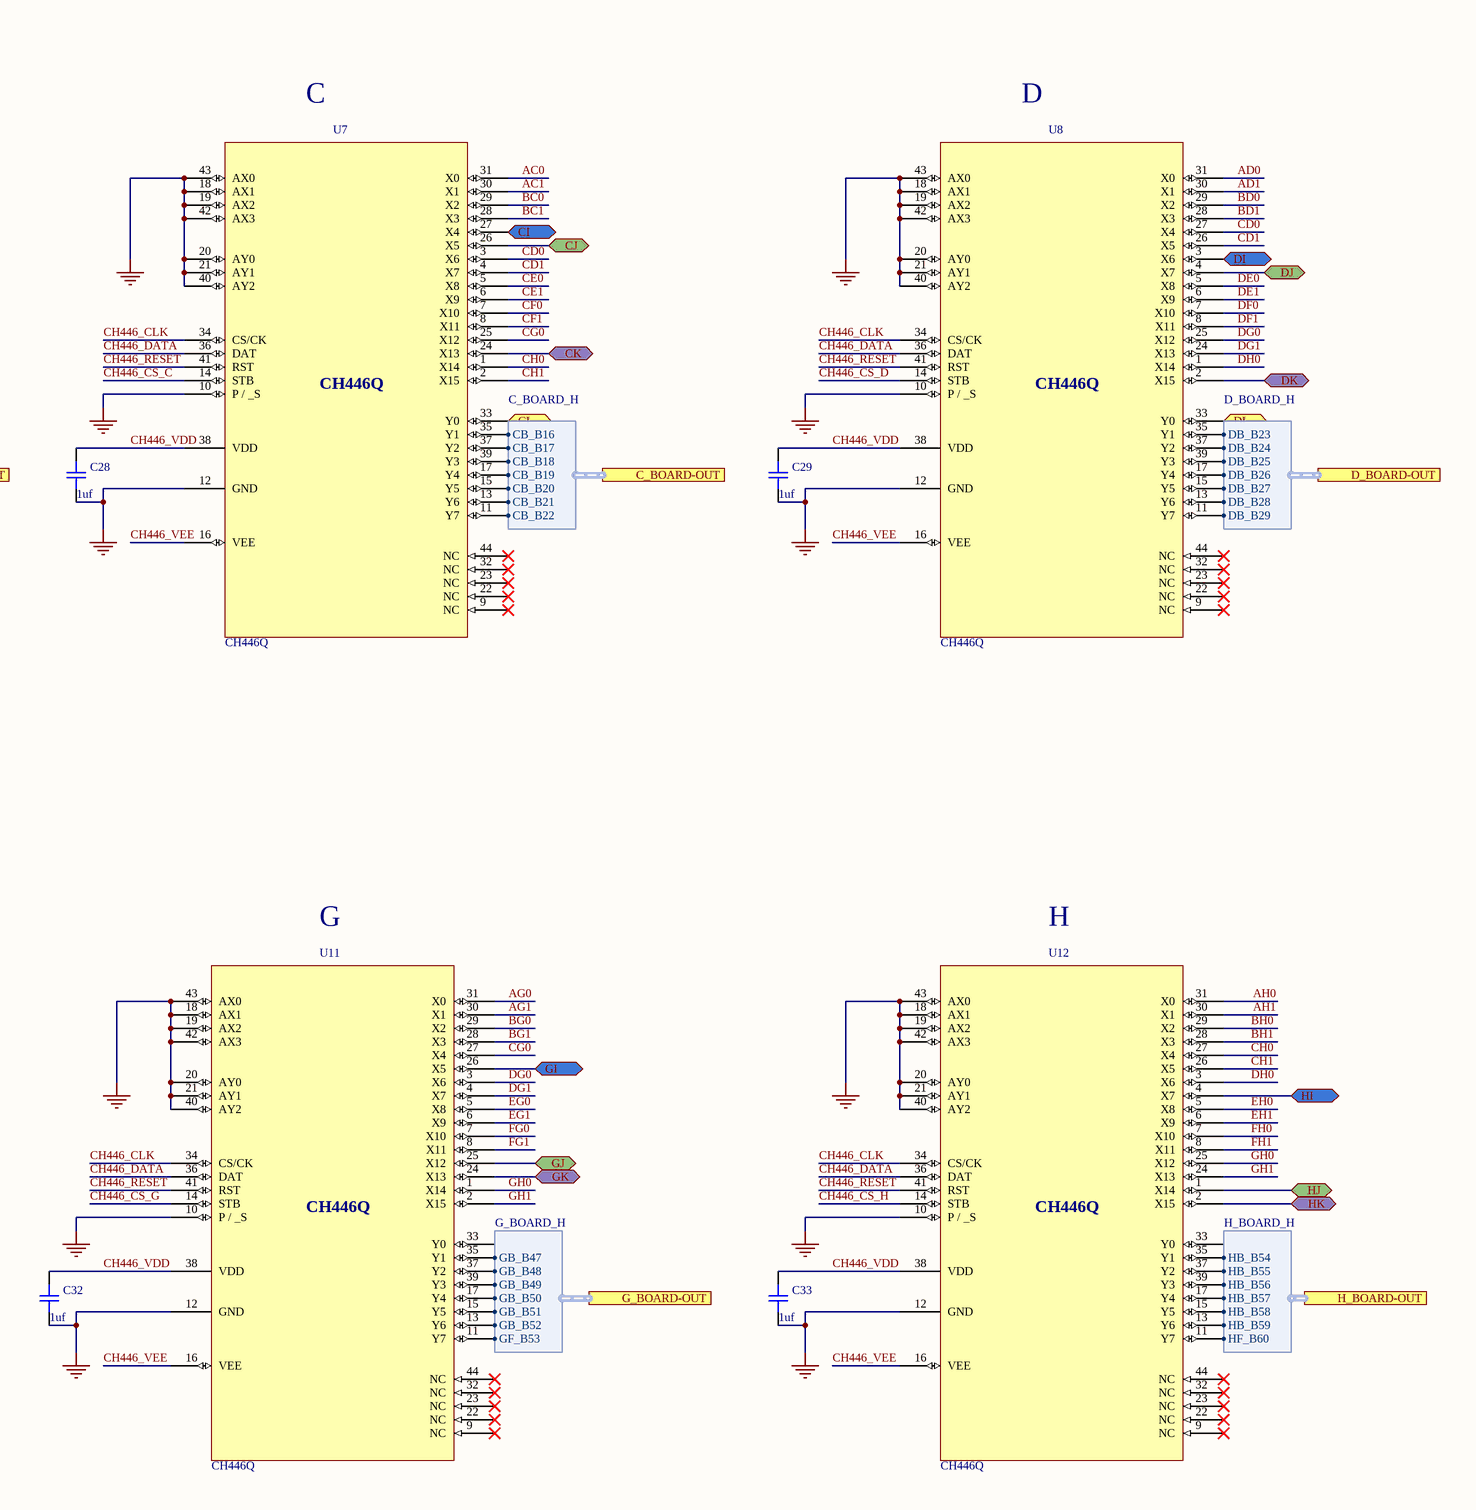
[diagram p6: BREADBOARD_MATTRIX.SchDoc, right]

### Parts
C26  1uf  [CAP_0603]
C27  1uf  [CAP_0603]
C28  1uf  [CAP_0603]
C29  1uf  [CAP_0603]
C30  1uf  [CAP_0603]
C31  1uf  [CAP_0603]
C32  1uf  [CAP_0603]
C33  1uf  [CAP_0603]
U5  CH446Q  [PG-LQFP-44]
U6  CH446Q  [PG-LQFP-44]
U7  CH446Q  [PG-LQFP-44]
U8  CH446Q  [PG-LQFP-44]
U9  CH446Q  [PG-LQFP-44]
U10  CH446Q  [PG-LQFP-44]
U11  CH446Q  [PG-LQFP-44]
U12  CH446Q  [PG-LQFP-44]

### Ports
A_BOARD-OUT (harness A_BOARD_H), AI (bidir), AJ (bidir), AK (bidir), AL (bidir), B_BOARD-OUT (harness B_BOARD_H), BI (bidir), BJ (bidir), BK (bidir), BL (bidir), C_BOARD-OUT (harness C_BOARD_H), CH_CLK (bidir), CH_CS_A (in), CH_CS_B (in), CH_CS_C (in), CH_CS_D (in), CH_CS_E (in), CH_CS_F (in), CH_CS_G (in), CH_CS_H (in), CH_DATA (bidir), CH_RST (bidir), CI (bidir), CJ (bidir), CK (bidir), CL (bidir), D_BOARD-OUT (harness D_BOARD_H), DI (bidir), DJ (bidir), DK (bidir), DL (bidir), E_BOARD-OUT (harness E_BOARD_H), EI (bidir), EJ (bidir), EK (bidir), EL (bidir), F_BOARD-OUT (harness F_BOARD_H), FI (bidir), FJ (bidir), FK (bidir), FL (bidir), G_BOARD-OUT (harness G_BOARD_H), GI (bidir), GJ (bidir), GK (bidir), GL (bidir), H_BOARD-OUT (harness H_BOARD_H), HI (bidir), HJ (bidir), HK (bidir), HL (bidir)

### Harnesses
A_BOARD_H: AB_B2, AB_B3, AB_B4, AB_B5, AB_B6, AB_B7, AB_B8
B_BOARD_H: BB_B9, BB_B10, BB_B11, BB_B12, BB_B13, BB_B14, BB_B15
C_BOARD_H: CB_B16, CB_B17, CB_B18, CB_B19, CB_B20, CB_B21, CB_B22
D_BOARD_H: DB_B23, DB_B24, DB_B25, DB_B26, DB_B27, DB_B28, DB_B29
E_BOARD_H: EB_B33, EB_B34, EB_B35, EB_B36, EB_B37, EB_B38, EB_B39
F_BOARD_H: FB_B40, FB_B41, FB_B42, FB_B43, FB_B44, FB_B45, EF_B46
G_BOARD_H: GB_B47, GB_B48, GB_B49, GB_B50, GB_B51, GB_B52, GF_B53
H_BOARD_H: HB_B54, HB_B55, HB_B56, HB_B57, HB_B58, HB_B59, HF_B60

### Nets
CH446_VDD: C26.2 C27.2 C28.2 C29.2 C30.2 C31.2 C32.2 C33.2 U5.38(VDD) U6.38(VDD) U7.38(VDD) U8.38(VDD) U9.38(VDD) U10.38(VDD) U11.38(VDD) U12.38(VDD)  [also labelled +9V]
CH446_VEE: U5.16(VEE) U6.16(VEE) U7.16(VEE) U8.16(VEE) U9.16(VEE) U10.16(VEE) U11.16(VEE) U12.16(VEE)  [also labelled -9V]
GND: C26.1 C27.1 C28.1 C29.1 C30.1 C31.1 C32.1 C33.1 U5.10(P_/__S) U5.12(GND) U5.18(AX1) U5.19(AX2) U5.20(AY0) U5.21(AY1) U5.40(AY2) U5.42(AX3) U5.43(AX0) U6.10(P_/__S) U6.12(GND) U6.18(AX1) U6.19(AX2) U6.20(AY0) U6.21(AY1) U6.40(AY2) U6.42(AX3) U6.43(AX0) U7.10(P_/__S) U7.12(GND) U7.18(AX1) U7.19(AX2) U7.20(AY0) U7.21(AY1) U7.40(AY2) U7.42(AX3) U7.43(AX0) U8.10(P_/__S) U8.12(GND) U8.18(AX1) U8.19(AX2) U8.20(AY0) U8.21(AY1) U8.40(AY2) U8.42(AX3) U8.43(AX0) U9.10(P_/__S) U9.12(GND) U9.18(AX1) U9.19(AX2) U9.20(AY0) U9.21(AY1) U9.40(AY2) U9.42(AX3) U9.43(AX0) U10.10(P_/__S) U10.12(GND) U10.18(AX1) U10.19(AX2) U10.20(AY0) U10.21(AY1) U10.40(AY2) U10.42(AX3) U10.43(AX0) U11.10(P_/__S) U11.12(GND) U11.18(AX1) U11.19(AX2) U11.20(AY0) U11.21(AY1) U11.40(AY2) U11.42(AX3) U11.43(AX0) U12.10(P_/__S) U12.12(GND) U12.18(AX1) U12.19(AX2) U12.20(AY0) U12.21(AY1) U12.40(AY2) U12.42(AX3) U12.43(AX0)  [project net REF]
AB0: U5.29(X2) U6.31(X0)  [project net AB0_3]
AB1: U5.28(X3) U6.30(X1)  [project net AB1_3]
AC0: U5.27(X4) U7.31(X0)  [project net AC0_3]
AC1: U5.26(X5) U7.30(X1)  [project net AC1_3]
AD0: U5.3(X6) U8.31(X0)  [project net AD0_3]
AD1: U5.4(X7) U8.30(X1)  [project net AD1_3]
AE0: U5.5(X8) U9.31(X0)  [project net AE0_3]
AF0: U5.7(X10) U10.31(X0)  [project net AF0_3]
AF1: U5.8(X11) U10.30(X1)  [project net AF1_3]
AG0: U5.25(X12) U11.31(X0)  [project net AG0_3]
AG1: U5.24(X13) U11.30(X1)  [project net AG1_3]
AH0: U5.1(X14) U12.31(X0)  [project net AH0_3]
AH1: U5.2(X15) U12.30(X1)  [project net AH1_3]
B_B2: U5.35(Y1) ; port A_BOARD-OUT.AB_B2
B_B3: U5.37(Y2) ; port A_BOARD-OUT.AB_B3
B_B4: U5.39(Y3) ; port A_BOARD-OUT.AB_B4
B_B5: U5.17(Y4) ; port A_BOARD-OUT.AB_B5
B_B6: U5.15(Y5) ; port A_BOARD-OUT.AB_B6
B_B7: U5.13(Y6) ; port A_BOARD-OUT.AB_B7
B_B8: U5.11(Y7) ; port A_BOARD-OUT.AB_B8
B_B9: U6.35(Y1) ; port B_BOARD-OUT.BB_B9
B_B10: U6.37(Y2) ; port B_BOARD-OUT.BB_B10
B_B11: U6.39(Y3) ; port B_BOARD-OUT.BB_B11
B_B12: U6.17(Y4) ; port B_BOARD-OUT.BB_B12
B_B13: U6.15(Y5) ; port B_BOARD-OUT.BB_B13
B_B14: U6.13(Y6) ; port B_BOARD-OUT.BB_B14
B_B15: U6.11(Y7) ; port B_BOARD-OUT.BB_B15
B_B16: U7.35(Y1) ; port C_BOARD-OUT.CB_B16
B_B17: U7.37(Y2) ; port C_BOARD-OUT.CB_B17
B_B18: U7.39(Y3) ; port C_BOARD-OUT.CB_B18
B_B19: U7.17(Y4) ; port C_BOARD-OUT.CB_B19
B_B20: U7.15(Y5) ; port C_BOARD-OUT.CB_B20
B_B21: U7.13(Y6) ; port C_BOARD-OUT.CB_B21
B_B22: U7.11(Y7) ; port C_BOARD-OUT.CB_B22
B_B23: U8.35(Y1) ; port D_BOARD-OUT.DB_B23
B_B24: U8.37(Y2) ; port D_BOARD-OUT.DB_B24
B_B25: U8.39(Y3) ; port D_BOARD-OUT.DB_B25
B_B26: U8.17(Y4) ; port D_BOARD-OUT.DB_B26
B_B27: U8.15(Y5) ; port D_BOARD-OUT.DB_B27
B_B28: U8.13(Y6) ; port D_BOARD-OUT.DB_B28
B_B29: U8.11(Y7) ; port D_BOARD-OUT.DB_B29
B_B33: U9.35(Y1) ; port E_BOARD-OUT.EB_B33
B_B34: U9.37(Y2) ; port E_BOARD-OUT.EB_B34
B_B35: U9.39(Y3) ; port E_BOARD-OUT.EB_B35
B_B36: U9.17(Y4) ; port E_BOARD-OUT.EB_B36
B_B37: U9.15(Y5) ; port E_BOARD-OUT.EB_B37
B_B38: U9.13(Y6) ; port E_BOARD-OUT.EB_B38
B_B39: U9.11(Y7) ; port E_BOARD-OUT.EB_B39
B_B40: U10.35(Y1) ; port F_BOARD-OUT.FB_B40
B_B41: U10.37(Y2) ; port F_BOARD-OUT.FB_B41
B_B42: U10.39(Y3) ; port F_BOARD-OUT.FB_B42
B_B43: U10.17(Y4) ; port F_BOARD-OUT.FB_B43
B_B44: U10.15(Y5) ; port F_BOARD-OUT.FB_B44
B_B45: U10.13(Y6) ; port F_BOARD-OUT.FB_B45
B_B46: U10.11(Y7) ; port F_BOARD-OUT.EF_B46
B_B47: U11.35(Y1) ; port G_BOARD-OUT.GB_B47
B_B48: U11.37(Y2) ; port G_BOARD-OUT.GB_B48
B_B49: U11.39(Y3) ; port G_BOARD-OUT.GB_B49
B_B50: U11.17(Y4) ; port G_BOARD-OUT.GB_B50
B_B51: U11.15(Y5) ; port G_BOARD-OUT.GB_B51
B_B52: U11.13(Y6) ; port G_BOARD-OUT.GB_B52
B_B53: U11.11(Y7) ; port G_BOARD-OUT.GF_B53
B_B54: U12.35(Y1) ; port H_BOARD-OUT.HB_B54
B_B55: U12.37(Y2) ; port H_BOARD-OUT.HB_B55
B_B56: U12.39(Y3) ; port H_BOARD-OUT.HB_B56
B_B57: U12.17(Y4) ; port H_BOARD-OUT.HB_B57
B_B58: U12.15(Y5) ; port H_BOARD-OUT.HB_B58
B_B59: U12.13(Y6) ; port H_BOARD-OUT.HB_B59
B_B60: U12.11(Y7) ; port H_BOARD-OUT.HF_B60
BC0: U6.27(X4) U7.29(X2)  [project net BC0_3]
BC1: U6.26(X5) U7.28(X3)  [project net BC1_3]
BD0: U6.3(X6) U8.29(X2)  [project net BD0_3]
BD1: U6.4(X7) U8.28(X3)  [project net BD1_3]
BE0: U6.5(X8) U9.29(X2)  [project net BE0_3]
BE1: U6.6(X9) U9.28(X3)  [project net BE1_3]
BF0: U6.7(X10) U10.29(X2)  [project net BF0_3]
BG0: U6.25(X12) U11.29(X2)  [project net BG0_3]
BG1: U6.24(X13) U11.28(X3)  [project net BG1_3]
BH0: U6.1(X14) U12.29(X2)  [project net BH0_3]
BH1: U6.2(X15) U12.28(X3)  [project net BH1_3]
CD0: U7.3(X6) U8.27(X4)  [project net CD0_3]
CD1: U7.4(X7) U8.26(X5)  [project net CD1_3]
CE0: U7.5(X8) U9.27(X4)  [project net CE0_3]
CE1: U7.6(X9) U9.26(X5)  [project net CE1_3]
CF0: U7.7(X10) U10.27(X4)  [project net CF0_3]
CF1: U7.8(X11) U10.26(X5)  [project net CF1_3]
CG0: U7.25(X12) U11.27(X4)  [project net CG0_3]
CH0: U7.1(X14) U12.27(X4)  [project net CH0_3]
CH1: U7.2(X15) U12.26(X5)  [project net CH1_3]
CH446_CLK: U5.34(CS/CK) U6.34(CS/CK) U7.34(CS/CK) U8.34(CS/CK) U9.34(CS/CK) U10.34(CS/CK) U11.34(CS/CK) U12.34(CS/CK) ; port CH_CLK
CH446_CS_A: U5.14(STB) ; port CH_CS_A
CH446_CS_B: U6.14(STB) ; port CH_CS_B
CH446_CS_C: U7.14(STB) ; port CH_CS_C
CH446_CS_D: U8.14(STB) ; port CH_CS_D
CH446_CS_E: U9.14(STB) ; port CH_CS_E
CH446_CS_F: U10.14(STB) ; port CH_CS_F
CH446_CS_G: U11.14(STB) ; port CH_CS_G
CH446_CS_H: U12.14(STB) ; port CH_CS_H
CH446_DATA: U5.36(DAT) U6.36(DAT) U7.36(DAT) U8.36(DAT) U9.36(DAT) U10.36(DAT) U11.36(DAT) U12.36(DAT) ; port CH_DATA
CH446_RESET: U5.41(RST) U6.41(RST) U7.41(RST) U8.41(RST) U9.41(RST) U10.41(RST) U11.41(RST) U12.41(RST) ; port CH_RST
CROSS_AI: U5.31(X0) ; port AI
CROSS_AJ: U5.30(X1) ; port AJ
CROSS_AK: U5.6(X9) ; port AK
CROSS_AL: U5.33(Y0) ; port AL
CROSS_BI: U6.29(X2) ; port BI
CROSS_BJ: U6.28(X3) ; port BJ
CROSS_BK: U6.8(X11) ; port BK
CROSS_BL: U6.33(Y0) ; port BL
CROSS_CI: U7.27(X4) ; port CI
CROSS_CJ: U7.26(X5) ; port CJ
CROSS_CK: U7.24(X13) ; port CK
CROSS_CL: U7.33(Y0) ; port CL
CROSS_DI: U8.3(X6) ; port DI
CROSS_DJ: U8.4(X7) ; port DJ
CROSS_DK: U8.2(X15) ; port DK
CROSS_DL: U8.33(Y0) ; port DL
CROSS_EI: U9.30(X1) ; port EI
CROSS_EJ: U9.5(X8) ; port EJ
CROSS_EK: U9.6(X9) ; port EK
CROSS_EL: U9.33(Y0) ; port EL
CROSS_FI: U10.28(X3) ; port FI
CROSS_FJ: U10.7(X10) ; port FJ
CROSS_FK: U10.8(X11) ; port FK
CROSS_FL: U10.33(Y0) ; port FL
CROSS_GI: U11.26(X5) ; port GI
CROSS_GJ: U11.25(X12) ; port GJ
CROSS_GK: U11.24(X13) ; port GK
CROSS_GL: U11.33(Y0) ; port GL
CROSS_HI: U12.4(X7) ; port HI
CROSS_HJ: U12.1(X14) ; port HJ
CROSS_HK: U12.2(X15) ; port HK
CROSS_HL: U12.33(Y0) ; port HL
DE0: U8.5(X8) U9.3(X6)  [project net DE0_3]
DE1: U8.6(X9) U9.4(X7)  [project net DE1_3]
DF0: U8.7(X10) U10.3(X6)  [project net DF0_3]
DF1: U8.8(X11) U10.4(X7)  [project net DF1_3]
DG0: U8.25(X12) U11.3(X6)  [project net DG0_3]
DG1: U8.24(X13) U11.4(X7)  [project net DG1_3]
DH0: U8.1(X14) U12.3(X6)  [project net DH0_3]
EF0: U9.7(X10) U10.5(X8)  [project net EF0_3]
EF1: U9.8(X11) U10.6(X9)  [project net EF1_3]
EG0: U9.25(X12) U11.5(X8)  [project net EG0_3]
EG1: U9.24(X13) U11.6(X9)  [project net EG1_3]
EH0: U9.1(X14) U12.5(X8)  [project net EH0_3]
EH1: U9.2(X15) U12.6(X9)  [project net EH1_3]
FG0: U10.25(X12) U11.7(X10)  [project net FG0_3]
FG1: U10.24(X13) U11.8(X11)  [project net FG1_3]
FH0: U10.1(X14) U12.7(X10)  [project net FH0_3]
FH1: U10.2(X15) U12.8(X11)  [project net FH1_3]
GH0: U11.1(X14) U12.25(X12)  [project net GH0_3]
GH1: U11.2(X15) U12.24(X13)  [project net GH1_3]

Not connected (* = marked no-connect by the designer): U5 9(NC)* 22(NC)* 23(NC)* 32(NC)* 44(NC)*; U6 9(NC)* 22(NC)* 23(NC)* 32(NC)* 44(NC)*; U7 9(NC)* 22(NC)* 23(NC)* 32(NC)* 44(NC)*; U8 9(NC)* 22(NC)* 23(NC)* 32(NC)* 44(NC)*; U9 9(NC)* 22(NC)* 23(NC)* 32(NC)* 44(NC)*; U10 9(NC)* 22(NC)* 23(NC)* 32(NC)* 44(NC)*; U11 9(NC)* 22(NC)* 23(NC)* 32(NC)* 44(NC)*; U12 9(NC)* 22(NC)* 23(NC)* 32(NC)* 44(NC)*

### Notes on the sheet
- A
- B
- C
- D
- E
- F
- G
- H

### Library data of the parts
C26-C33 = CAP_0603: Capacitor SMD 0603; Manufacturer: *; Manufacturer Part Number: *; Distributor Link: *; LCSC: *; Rating: *; Dielectric: *

## Sheet RP2040 MCU.SchDoc
size A3; SheetNumber: 5; SheetTotal: 14
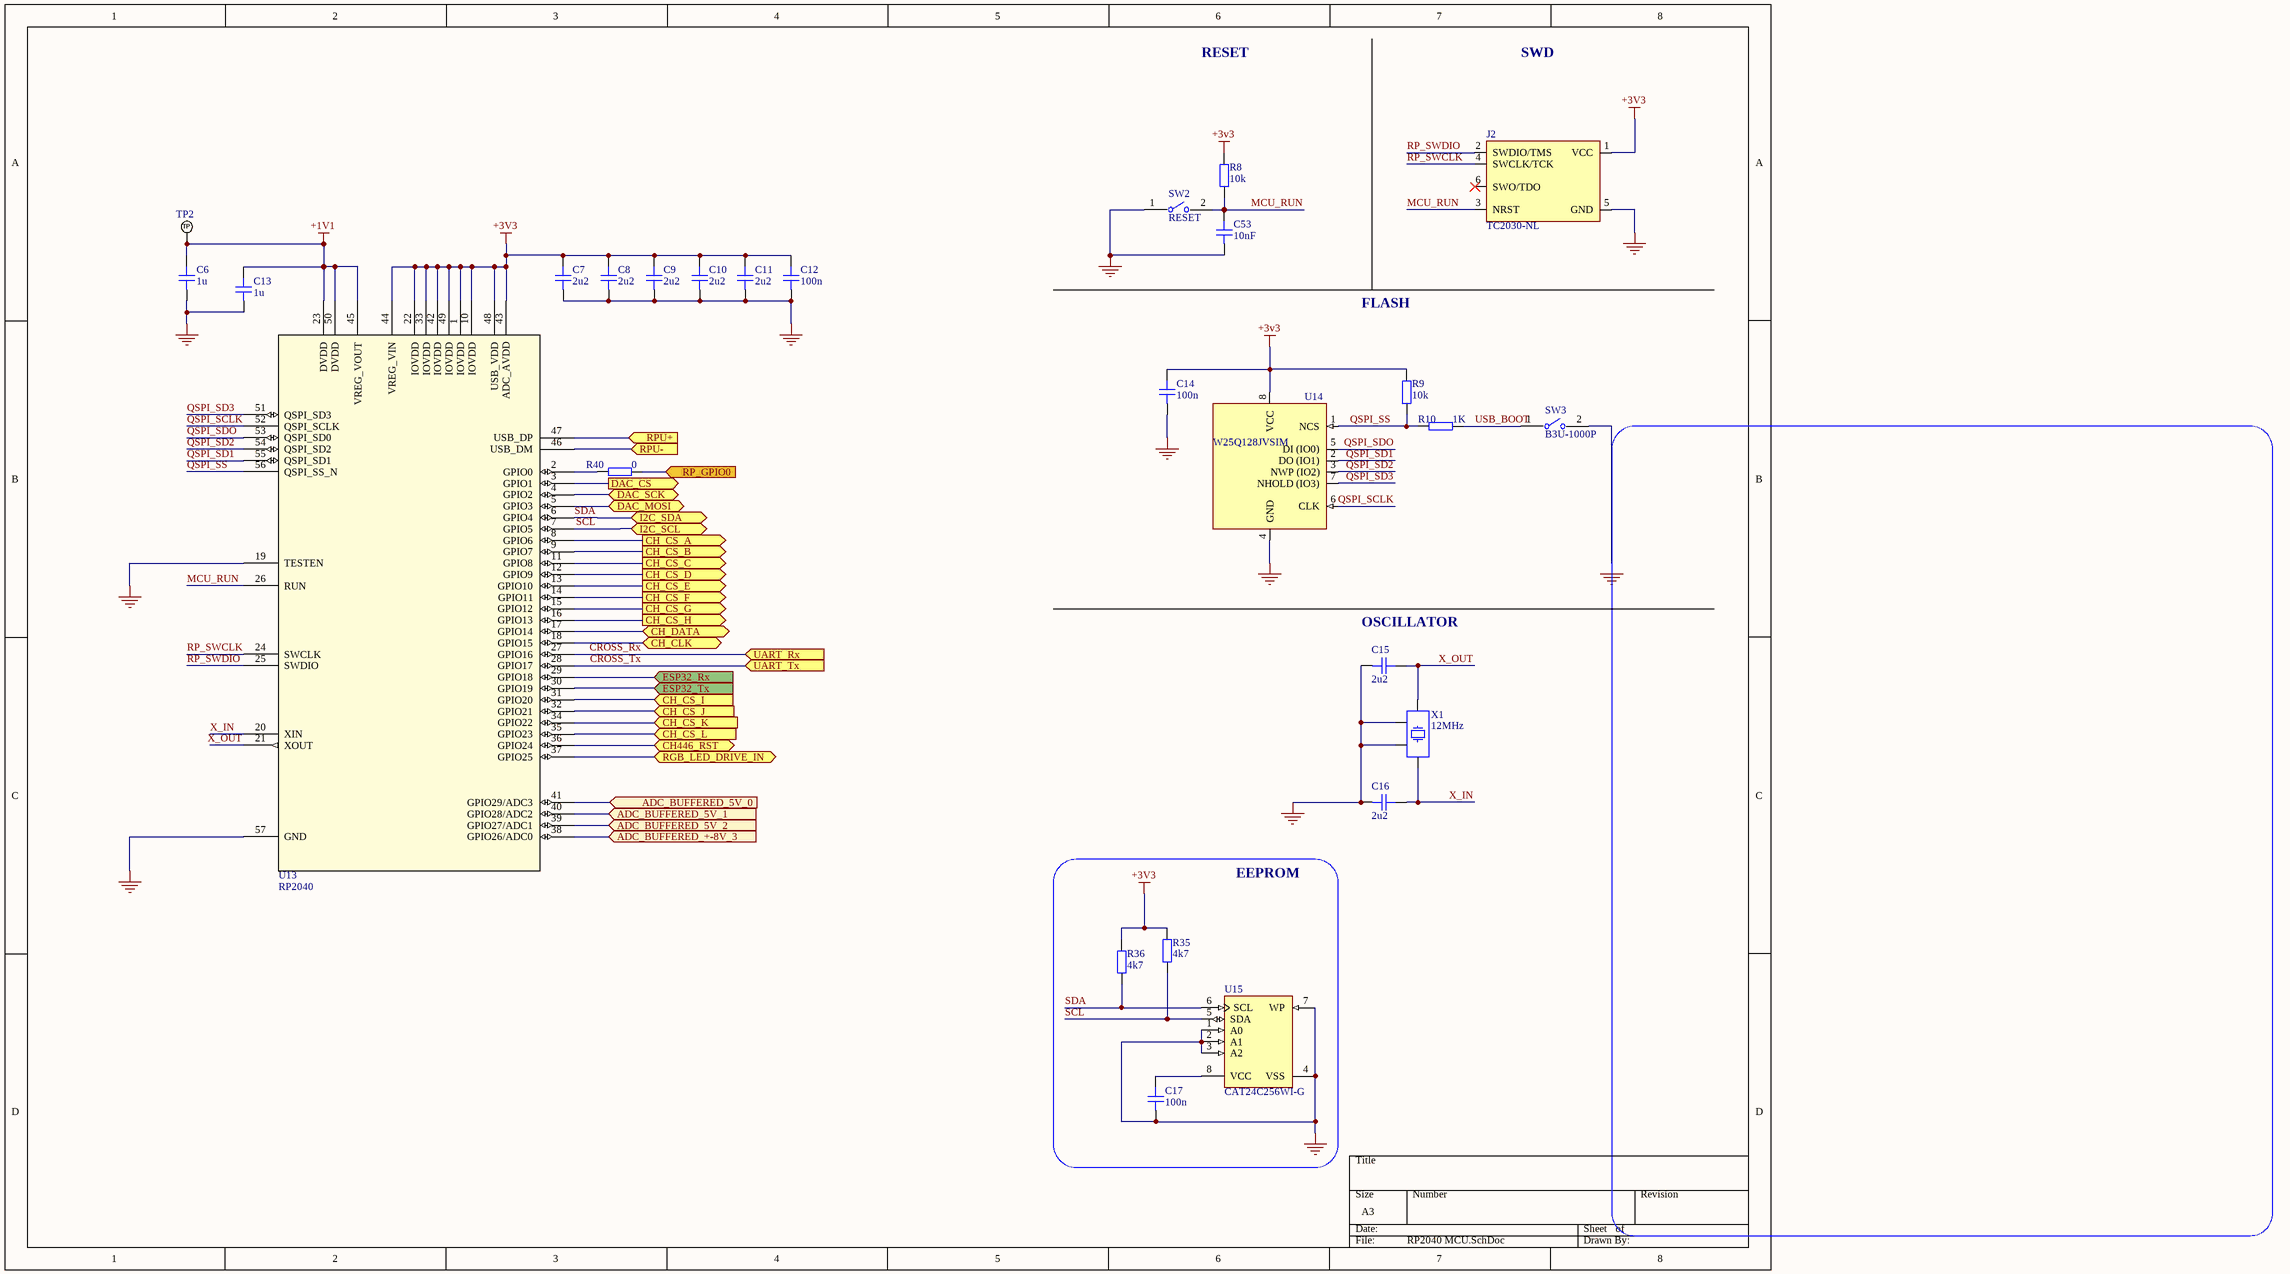
[diagram p7: RP2040 MCU.SchDoc]

### Parts
C6  1u  [CAP_0603]
C7  2u2  [CAP_0603]
C8  2u2  [CAP_0603]
C9  2u2  [CAP_0603]
C10  2u2  [CAP_0603]
C11  2u2  [CAP_0603]
C12  100n  [CAP_0603]
C13  1u  [CAP_0603]
C14  100n  [CAP_0603]
C15  2u2  [CAP_0603]
C16  2u2  [CAP_0603]
C17  100n  [CAP_0603]
C53  10nF  [CAP_0603]
J2  TC2030-NL  [TC2030-NL-FP]  (no BOM)
R8  10k  [RES_0603]
R9  10k  [RES_0603]
R10  1K  [RES_0603]
R35  4k7  [RES_0603]
R36  4k7  [RES_0603]
R40  0  [RES_0603]
SW2  RESET  [FP-B3U-1000P-MFG]
SW3  B3U-1000P  [FP-B3U-1000P-MFG]
TP2  TP_NOBOM  [PAD_RND_1MM]  (value not drawn)  (no BOM)
U13  RP2040  [IC57_RP2040]
U14  W25Q128JVSIM  [SOIC-8]
U15  CAT24C256WI-G  [ONSC-SOIC-8-751BD-01_L]
X1  12MHz  [XTAL_3225]

### Blocks framed on the sheet
EEPROM: C17 R35 R36 U15

### Ports
ADC_BUFFERED_5V_0 (in), ADC_BUFFERED_5V_1 (in), ADC_BUFFERED_5V_2 (in), ADC_BUFFERED_+-8V_3 (in), CH446_RST (bidir), CH_CLK (bidir), CH_CS_A (out), CH_CS_B (out), CH_CS_C (out), CH_CS_D (out), CH_CS_E (out), CH_CS_F (out), CH_CS_G (out), CH_CS_H (out), CH_CS_I (in), CH_CS_J (in), CH_CS_K (in), CH_CS_L (in), CH_DATA (bidir), DAC_CS (out), DAC_MOSI (bidir), DAC_SCK (bidir), ESP32_Rx (in), ESP32_Tx (in), I2C_SCL (bidir), I2C_SDA (bidir), RGB_LED_DRIVE_IN (bidir), RP_GPIO0 (in), RPU+ (in), RPU- (in), UART_Rx (in), UART_Tx (in)

### Nets
+1V1: C6.2 C13.2 TP2.1(TP) U13.23(DVDD) U13.45(VREG_VOUT) U13.50(DVDD)
+3v3: C7.2 C8.2 C9.2 C10.2 C11.2 C12.2 C14.2 J2.1(VCC) R8.2 R9.2 R35.2 R36.2 U13.1(IOVDD) U13.10(IOVDD) U13.22(IOVDD) U13.33(IOVDD) U13.42(IOVDD) U13.43(ADC_AVDD) U13.44(VREG_VIN) U13.48(USB_VDD) U13.49(IOVDD) U14.8(VCC)  [project net BUCK1_3v3]
GND: C6.1 C7.1 C8.1 C9.1 C10.1 C11.1 C12.1 C13.1 C14.1 C15.1 C16.1 C17.1 C53.1 J2.5(GND) SW2.1 SW3.2 U13.19(TESTEN) U13.57(GND) U14.4(GND) U15.1(A0) U15.2(A1) U15.3(A2) U15.4(VSS) U15.7(WP) X1.2 X1.4  [project net REF]
ADC_BUFF_5V_0: U13.41(GPIO29/ADC3) ; port ADC_BUFFERED_5V_0
ADC_BUFF_5V_1: U13.40(GPIO28/ADC2) ; port ADC_BUFFERED_5V_1
ADC_BUFF_5V_2: U13.39(GPIO27/ADC1) ; port ADC_BUFFERED_5V_2
ADC_BUFF_+-8V: U13.38(GPIO26/ADC0) ; port ADC_BUFFERED_+-8V_3
CH446_CLK: U13.18(GPIO15) ; port CH_CLK
CH446_CS_A: U13.8(GPIO6) ; port CH_CS_A
CH446_CS_B: U13.9(GPIO7) ; port CH_CS_B
CH446_CS_C: U13.11(GPIO8) ; port CH_CS_C
CH446_CS_D: U13.12(GPIO9) ; port CH_CS_D
CH446_CS_E: U13.13(GPIO10) ; port CH_CS_E
CH446_CS_F: U13.14(GPIO11) ; port CH_CS_F
CH446_CS_G: U13.15(GPIO12) ; port CH_CS_G
CH446_CS_H: U13.16(GPIO13) ; port CH_CS_H
CH446_CS_I: U13.31(GPIO20) ; port CH_CS_I
CH446_CS_J: U13.32(GPIO21) ; port CH_CS_J
CH446_CS_K: U13.34(GPIO22) ; port CH_CS_K
CH446_CS_L: U13.35(GPIO23) ; port CH_CS_L
CH446_DATA: U13.17(GPIO14) ; port CH_DATA
CH446_RESET: U13.36(GPIO24) ; port CH446_RST
CROSS_Rx: U13.27(GPIO16) ; port UART_Rx
CROSS_Tx: U13.28(GPIO17) ; port UART_Tx
DAC-SS: U13.3(GPIO1) ; port DAC_CS
DAC_CLOCK: U13.4(GPIO2) ; port DAC_SCK
DAC_DATA: U13.5(GPIO3) ; port DAC_MOSI
ESP32_Rx: U13.29(GPIO18) ; port ESP32_Rx
ESP32_Tx: U13.30(GPIO19) ; port ESP32_Tx
GPIO0_RP: R40.1 ; port RP_GPIO0
MCU_RUN: C53.2 J2.3(NRST) R8.1 SW2.2 U13.26(RUN)  [project net MCU_RUN_5]
QSPI_SCLK: U13.52(QSPI_SCLK) U14.6(CLK)  [project net QSPI_SCLK_5]
QSPI_SD1: U13.55(QSPI_SD1) U14.2(DO_(IO1))  [project net QSPI_SD1_5]
QSPI_SD2: U13.54(QSPI_SD2) U14.3(NWP_(IO2))  [project net QSPI_SD2_5]
QSPI_SD3: U13.51(QSPI_SD3) U14.7(NHOLD_(IO3))  [project net QSPI_SD3_5]
QSPI_SDO: U13.53(QSPI_SD0) U14.5(DI_(IO0))  [project net QSPI_SDO_5]
QSPI_SS: R9.1 R10.1 U13.56(QSPI_SS_N) U14.1(NCS)  [project net QSPI_SS_5]
RGB_CONTROL: U13.37(GPIO25) ; port RGB_LED_DRIVE_IN
RP_N: U13.46(USB_DM) ; port RPU-
RP_P: U13.47(USB_DP) ; port RPU+
RP_SWCLK: J2.4(SWCLK/TCK) U13.24(SWCLK)  [project net RP_SWCLK_5]
RP_SWDIO: J2.2(SWDIO/TMS) U13.25(SWDIO)  [project net RP_SWDIO_5]
SCL: R35.1 U13.7(GPIO5) U15.5(SDA) ; port I2C_SCL  [project net CURRENT_SCL]
SDA: R36.1 U13.6(GPIO4) U15.6(SCL) ; port I2C_SDA  [project net CURRENT_SDA]
USB_BOOT: R10.2 SW3.1  [project net USB_BOOT_5]
X_IN: C16.2 U13.20(XIN) X1.3  [project net X_IN_5]
X_OUT: C15.2 U13.21(XOUT) X1.1  [project net X_OUT_5]
NetC17_2: C17.2 U15.8(VCC)
NetR40_2: R40.2 U13.2(GPIO0)

Not connected (* = marked no-connect by the designer): J2 6(SWO/TDO)*

### Notes on the sheet
- RESET
- SWD
- FLASH
- (near C15) OSCILLATOR

### Library data of the parts
C6-C17 C53 = CAP_0603: Capacitor SMD 0603; Manufacturer: *; Manufacturer Part Number: *; Distributor Link: *; LCSC: *; Rating: *; Dielectric: *
J2 = TC2030-NL: Tag-Connect No-Solder SWD Debug Connector (No Legs) DO NOT PLACE; Manufacturer: Tag-Connect; Manufacturer Part Number: TC2030-NL-FP
R8-R10 R35 R36 R40 = RES_0603: Resistor SMD 0603; Manufacturer: *; Manufacturer Part Number: *; Distributor Link: *; LCSC: *
SW2 SW3 = CMP-2100-03586-2: SWITCH TACTILE SPST-NO 0.05A 12V; Contact Resistance: 100mR; Operating Force: 1.5N; Max Current Rating: 50mA; Switch Travel: 0.15mm; Actuator Type: Standard; Mechanical Life: 200000Cycles; Ratings: Dust Proof; Illumination Type: Non-Illuminated; Throw Configuration: SPST; Actuator Length: 0.4mm; Switch Function: Off-Mom; Height: 1.2mm; Width: 3mm; Weight: 0.000776oz; Contact Material: Silver; Max Voltage Rating (DC): 12V; Insulation Resistance: 100MR; Lead Free: Lead Free; Current Rating: 50mA; Termination: SMD/SMT; Length: 4mm; Voltage Rating (DC): 12V; Contact Current Rating: 50mA; Orientation: Straight; Depth: 2.5mm; Max Operating Temperature: 70°C; Packaging: Tape and Reel; Min Operating Temperature: -25°C; Package Quantity: 1; Mount: Surface Mount; Electrical Life: 200000Cycles
TP2 = TEST_POINT_RND_1MM: Test Point Round 1mm (NO BOM)
U13 = RP2040: No Description Available; Manufacturer_Name: Raspberry Pi; Copyright: Copyright (C) 2025 Ultra Librarian. All rights reserved.; Manufacturer_Part_Number: RP2040; RefDes: RefDes; Type: Type
U14 = W25Q128JVSIM: 128M-BIT / SERIAL FLASH MEMORY WITH / DUAL/QUAD SPI & QPI & DTR SOIC-8; Manufacturer: Winbond; Manufacturer Part Number: W25Q128JVSIM
U15 = CMP-2000-06068-1: I2C CMOS Serial EEPROM, 1.8 to 5.5 V, -40 to 85 degC, 8-Pin SOIC, RoHS, Tube; Manufacturer: ON Semiconductor; Operating Supply Voltage (Max): 5.5V; Frequency (Max): 0.1MHz; Operating Supply Voltage (Typ): 2.5/3.3/5V; Supply Current: 1mA; Data Retention: 100; Organization: 32Kx8; Programmable: Yes; Operating Supply Voltage (Min): 1.8V; Access Time (Max): 3500ns; Density: 262144Bit; Interface Type: Serial(I2C); DELETED: Compliant; Rad Hardened: No; Package Reference: SOIC-8-751BD-01; Manufacturer URL: http://www.onsemi.com/; Package Type: SOICN; Operating Temperature Classification: Industrial; Datasheet Version: Rev. 14, 01/2014; Datasheet URL: http://www.onsemi.com/pub_link/Collateral/CAT24C256-D.PDF; Operating Temp Range: -40Cto85C; Mounting: SurfaceMount; Package Description: 8-Pin Small Outline Integrated Circuit, Body 4.9 x 3.9 mm, Pitch 1.27 mm; Pin Count: 8; Operating Temperature (Max): 85C; Operating Temperature (Min): -40C; Frequency: 0.1MHz; Write Protection: Yes; Mounting Technology: SurfaceMount; Package URL: http://www.onsemi.com/pub_link/Collateral/751BD.PDF
X1 = TSX-3225_24.0000MF15X-AC: Crystal SMD 24MHz 10PPM 7pF 3225; Manufacturer: Epson; Manufacturer Part Number: TSX-3225 24.0000MF15X-AC

## Sheet ESP32 S3 MINI.SchDoc
size 389 x 241 mm; SheetNumber: 6; SheetTotal: 14
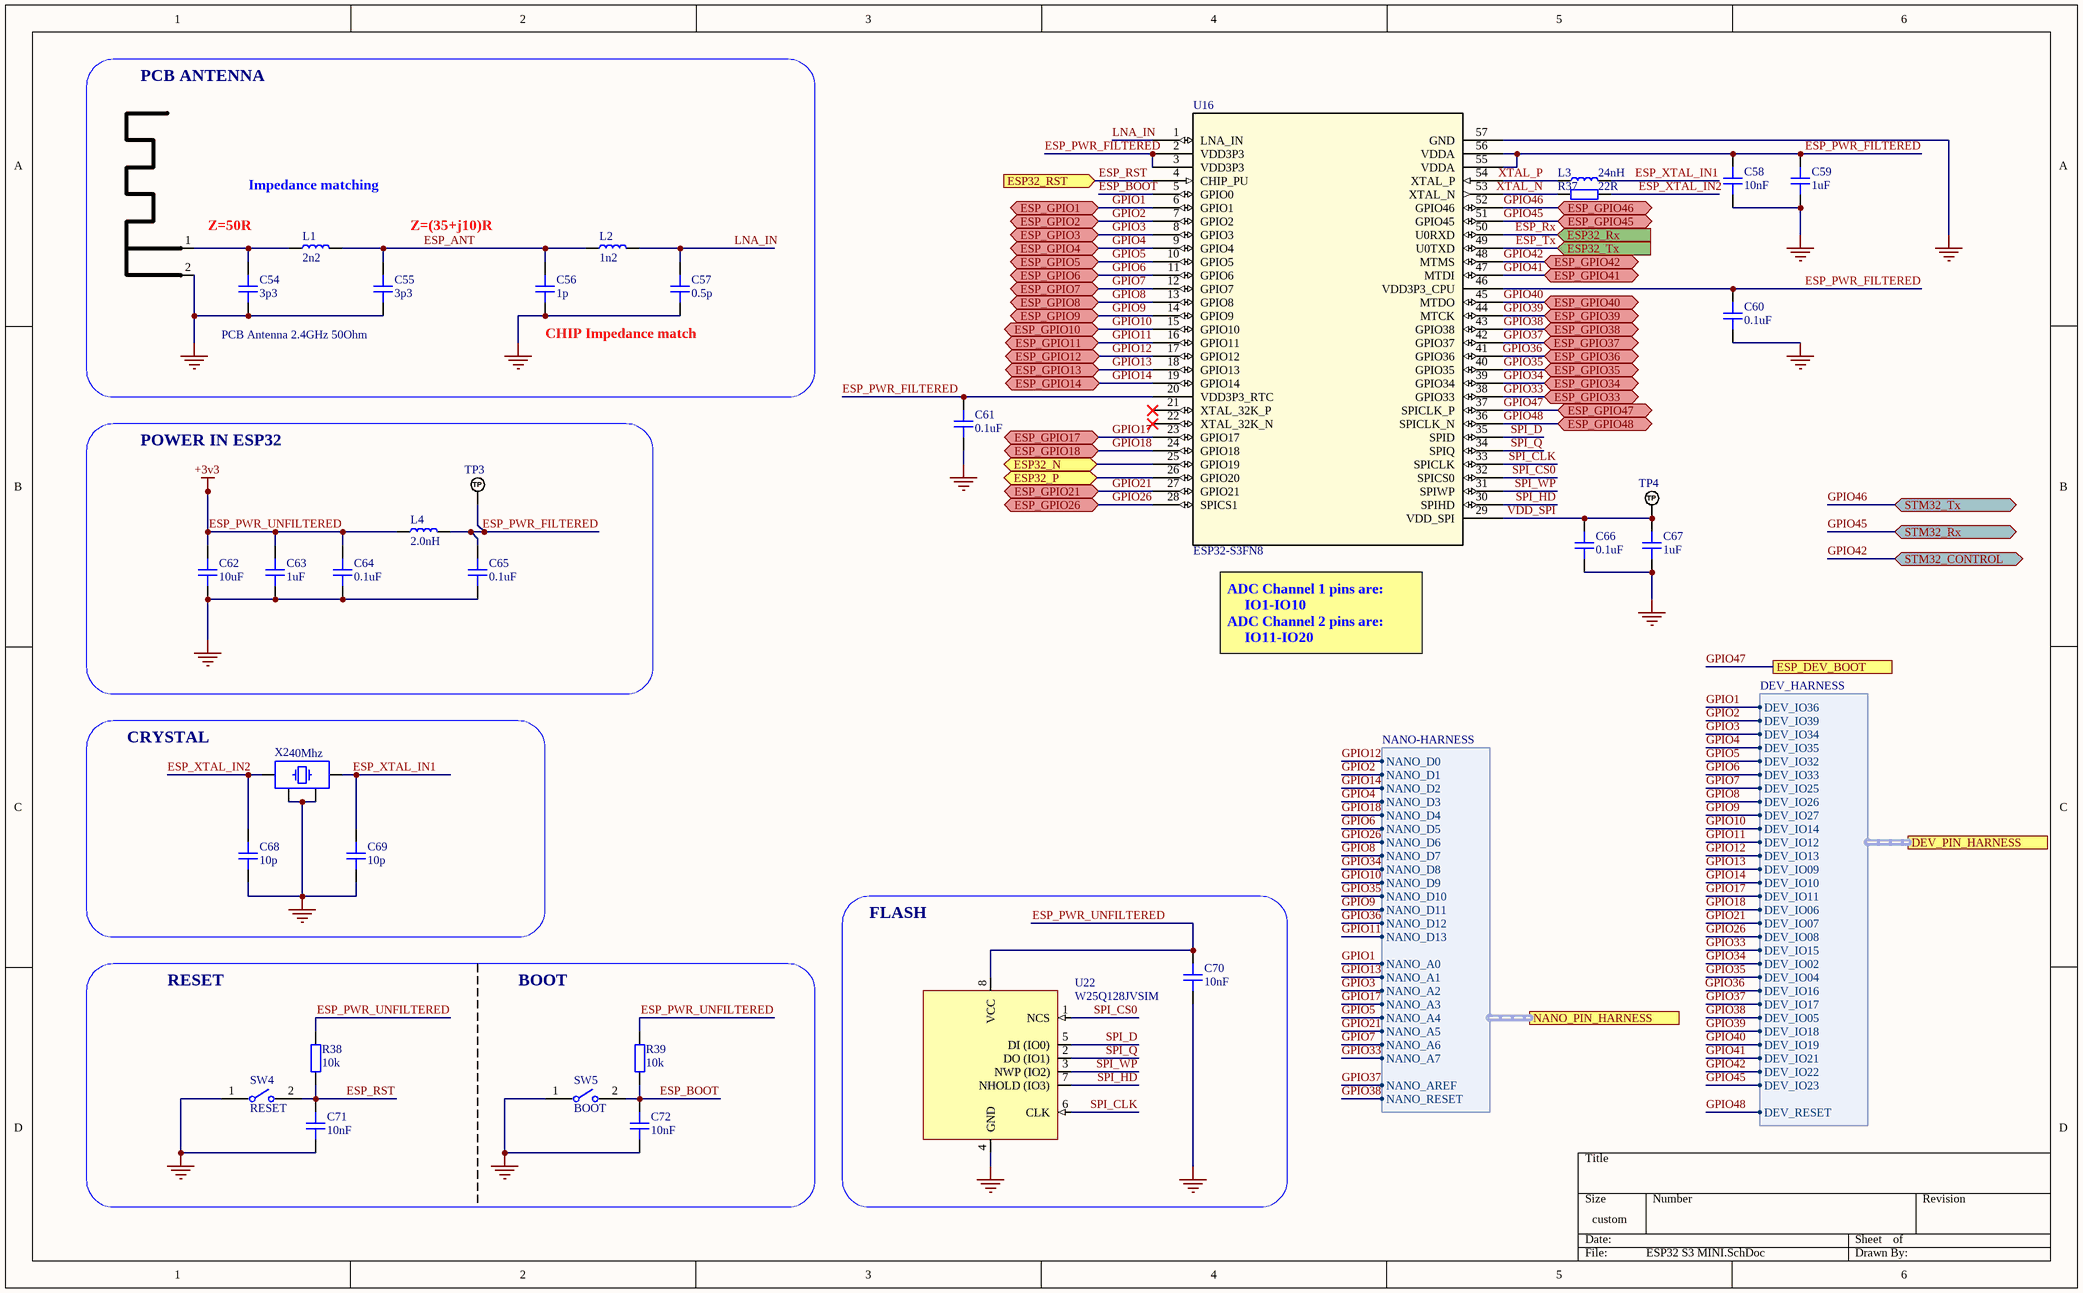
[diagram p8: ESP32 S3 MINI.SchDoc]

### Parts
ANT1  PCB Antenna 2.4GHz 50Ohm  [ANT_IFA_USB_2_4GHZ_50R]  (no BOM)
C54  3p3  [CAP_0603]
C55  3p3  [CAP_0603]
C56  1p  [CAP_0603]
C57  0.5p  [CAP_0603]
C58  10nF  [CAP_0603]
C59  1uF  [CAP_0603]
C60  0.1uF  [CAP_0603]
C61  0.1uF  [CAP_0603]
C62  10uF  [CAP_0603]
C63  1uF  [CAP_0603]
C64  0.1uF  [CAP_0603]
C65  0.1uF  [CAP_0603]
C66  0.1uF  [CAP_0603]
C67  1uF  [CAP_0603]
C68  10p  [CAP_0603]
C69  10p  [CAP_0603]
C70  10nF  [CAP_0603]
C71  10nF  [CAP_0603]
C72  10nF  [CAP_0603]
L1  2n2  [IND_0603]
L2  1n2  [IND_0603]
L3  24nH  [IND_0603]
L4  2.0nH  [IND_0603]
R37  22R  [RES_0603]
R38  10k  [RES_0603]
R39  10k  [RES_0603]
SW4  RESET  [FP-B3U-1000P-MFG]
SW5  BOOT  [FP-B3U-1000P-MFG]
TP3  TP_NOBOM  [PAD_RND_1MM]  (value not drawn)  (no BOM)
TP4  TP_NOBOM  [PAD_RND_1MM]  (value not drawn)  (no BOM)
U16  ESP32-S3FN8  [QFN56_7X7_EXP]
U22  W25Q128JVSIM  [SOIC-8]
X2  40Mhz  [XTAL_3225]

### Blocks framed on the sheet
PCB ANTENNA: ANT1 C54-C57 L1 L2
POWER IN ESP32: C62-C65 L4 TP3
CRYSTAL: C68 C69 X2
FLASH: C70 U22

### Ports
DEV_PIN_HARNESS (harness DEV_HARNESS), ESP32_N (bidir), ESP32_P (bidir), ESP32_RST (in), ESP32_Rx (in), ESP32_Tx (in), ESP_DEV_BOOT, ESP_GPIO1 (bidir), ESP_GPIO2 (bidir), ESP_GPIO3 (bidir), ESP_GPIO4 (bidir), ESP_GPIO5 (bidir), ESP_GPIO6 (bidir), ESP_GPIO7 (bidir), ESP_GPIO8 (bidir), ESP_GPIO9 (bidir), ESP_GPIO10 (bidir), ESP_GPIO11 (bidir), ESP_GPIO12 (bidir), ESP_GPIO13 (bidir), ESP_GPIO14 (bidir), ESP_GPIO17 (bidir), ESP_GPIO18 (bidir), ESP_GPIO21 (bidir), ESP_GPIO26 (bidir), ESP_GPIO33 (bidir), ESP_GPIO34 (bidir), ESP_GPIO35 (bidir), ESP_GPIO36 (bidir), ESP_GPIO37 (bidir), ESP_GPIO38 (bidir), ESP_GPIO39 (bidir), ESP_GPIO40 (bidir), ESP_GPIO41 (bidir), ESP_GPIO42 (bidir), ESP_GPIO45 (bidir), ESP_GPIO46 (bidir), ESP_GPIO47 (bidir), ESP_GPIO48 (bidir), NANO_PIN_HARNESS (harness NANO-HARNESS), STM32_CONTROL (bidir), STM32_Rx (bidir), STM32_Tx (bidir)

### Harnesses
NANO-HARNESS: NANO_D0, NANO_D1, NANO_D3, NANO_D4, NANO_D5, NANO_D6, NANO_D7, NANO_D8, NANO_D9, NANO_D10, NANO_D11, NANO_D12, NANO_D13, NANO_A0, NANO_A1, NANO_A2, NANO_A3, NANO_A4, NANO_A5, NANO_A6, NANO_A7, NANO_AREF, NANO_RESET, NANO_D2
DEV_HARNESS: DEV_IO36, DEV_IO39, DEV_IO34, DEV_IO35, DEV_IO32, DEV_IO33, DEV_IO25, DEV_IO26, DEV_IO27, DEV_IO14, DEV_IO12, DEV_IO13, DEV_IO09, DEV_IO10, DEV_IO11, DEV_IO06, DEV_IO07, DEV_IO08, DEV_IO15, DEV_IO02, DEV_IO04, DEV_IO16, DEV_IO17, DEV_IO05, DEV_IO18, DEV_IO19, DEV_IO21, DEV_IO22, DEV_IO23, DEV_RESET

### Nets
+3v3: C62.2 C63.2 C64.2 C70.2 L4.1 R38.2 R39.2 U22.8(VCC)  [also labelled ESP_PWR_UNFILTERED]  [project net BUCK1_3v3]
GND: ANT1.2(GND) C54.1 C55.1 C56.1 C57.1 C58.1 C59.1 C60.1 C61.1 C62.1 C63.1 C64.1 C65.1 C66.1 C67.1 C68.1 C69.1 C70.1 C71.1 C72.1 SW4.1 SW5.1 U16.57(GND) U22.4(GND) X2.2 X2.4  [project net REF]
\: U16.43(GPIO38) ; port ESP_GPIO38, port NANO_PIN_HARNESS.NANO_RESET, port DEV_PIN_HARNESS.DEV_IO05  [also labelled GPIO38]
ESP_ANT: C55.2 C56.2 L1.2 L2.1  [project net ESP_ANT_6]
ESP_BOOT: C72.2 R39.1 SW5.2 U16.5(GPIO0)  [project net ESP_BOOT_6]
ESP_N: U16.25(GPIO19) ; port ESP32_N
ESP_P: U16.26(GPIO20) ; port ESP32_P
ESP_PWR_FILTERED: C58.2 C59.2 C60.2 C61.2 C65.2 L4.2 TP3.1(TP) U16.2(VDD3P3) U16.3(VDD3P3) U16.20(VDD3P3_RTC) U16.46(VDD3P3_CPU) U16.55(VDDA) U16.56(VDDA)  [project net ESP_PWR_FILTERED_6]
ESP_RST: C71.2 R38.1 SW4.2 U16.4(CHIP_PU) ; port ESP32_RST  [project net ESP_RESET]
ESP_Rx: U16.50(U0RXD) ; port ESP32_Rx  [project net ESP32_Tx]
ESP_Tx: U16.49(U0TXD) ; port ESP32_Tx  [project net ESP32_Rx]
ESP_XTAL_IN1: C69.2 L3.2 X2.3  [project net ESP_XTAL_IN1_6]
ESP_XTAL_IN2: C68.2 R37.1 X2.1  [project net ESP_XTAL_IN2_6]
GPIO1: U16.6(GPIO1) ; port ESP_GPIO1, port NANO_PIN_HARNESS.NANO_A0, port DEV_PIN_HARNESS.DEV_IO36  [project net A0]
GPIO2: U16.7(GPIO2) ; port ESP_GPIO2, port NANO_PIN_HARNESS.NANO_D1, port DEV_PIN_HARNESS.DEV_IO39  [project net D1]
GPIO3: U16.8(GPIO3) ; port ESP_GPIO3, port NANO_PIN_HARNESS.NANO_A2, port DEV_PIN_HARNESS.DEV_IO34  [project net A2]
GPIO4: U16.9(GPIO4) ; port ESP_GPIO4, port NANO_PIN_HARNESS.NANO_D3, port DEV_PIN_HARNESS.DEV_IO35  [project net D3]
GPIO5: U16.10(GPIO5) ; port ESP_GPIO5, port NANO_PIN_HARNESS.NANO_A4, port DEV_PIN_HARNESS.DEV_IO32  [project net A4]
GPIO6: U16.11(GPIO6) ; port ESP_GPIO6, port NANO_PIN_HARNESS.NANO_D5, port DEV_PIN_HARNESS.DEV_IO33  [project net D5]
GPIO7: U16.12(GPIO7) ; port ESP_GPIO7, port NANO_PIN_HARNESS.NANO_A6, port DEV_PIN_HARNESS.DEV_IO25  [project net A6]
GPIO8: U16.13(GPIO8) ; port ESP_GPIO8, port NANO_PIN_HARNESS.NANO_D7, port DEV_PIN_HARNESS.DEV_IO26  [project net D7]
GPIO9: U16.14(GPIO9) ; port ESP_GPIO9, port NANO_PIN_HARNESS.NANO_D11, port DEV_PIN_HARNESS.DEV_IO27  [project net D11]
GPIO10: U16.15(GPIO10) ; port ESP_GPIO10, port NANO_PIN_HARNESS.NANO_D9, port DEV_PIN_HARNESS.DEV_IO14  [project net D9]
GPIO11: U16.16(GPIO11) ; port ESP_GPIO11, port NANO_PIN_HARNESS.NANO_D13, port DEV_PIN_HARNESS.DEV_IO12  [project net D13]
GPIO12: U16.17(GPIO12) ; port ESP_GPIO12, port NANO_PIN_HARNESS.NANO_D0, port DEV_PIN_HARNESS.DEV_IO13  [project net D0]
GPIO13: U16.18(GPIO13) ; port ESP_GPIO13, port NANO_PIN_HARNESS.NANO_A1, port DEV_PIN_HARNESS.DEV_IO09  [project net A1]
GPIO14: U16.19(GPIO14) ; port ESP_GPIO14, port NANO_PIN_HARNESS.NANO_D2, port DEV_PIN_HARNESS.DEV_IO10  [project net D2]
GPIO17: U16.23(GPIO17) ; port ESP_GPIO17, port NANO_PIN_HARNESS.NANO_A3, port DEV_PIN_HARNESS.DEV_IO11  [project net A3]
GPIO18: U16.24(GPIO18) ; port ESP_GPIO18, port NANO_PIN_HARNESS.NANO_D4, port DEV_PIN_HARNESS.DEV_IO06  [project net D4]
GPIO21: U16.27(GPIO21) ; port ESP_GPIO21, port NANO_PIN_HARNESS.NANO_A5, port DEV_PIN_HARNESS.DEV_IO07  [project net A5]
GPIO26: U16.28(SPICS1) ; port ESP_GPIO26, port NANO_PIN_HARNESS.NANO_D6, port DEV_PIN_HARNESS.DEV_IO08  [project net D6]
GPIO33: U16.38(GPIO33) ; port ESP_GPIO33, port NANO_PIN_HARNESS.NANO_A7, port DEV_PIN_HARNESS.DEV_IO15  [project net A7]
GPIO34: U16.39(GPIO34) ; port ESP_GPIO34, port NANO_PIN_HARNESS.NANO_D8, port DEV_PIN_HARNESS.DEV_IO02  [project net D8]
GPIO35: U16.40(GPIO35) ; port ESP_GPIO35, port NANO_PIN_HARNESS.NANO_D10, port DEV_PIN_HARNESS.DEV_IO04  [project net D10]
GPIO36: U16.41(GPIO36) ; port ESP_GPIO36, port NANO_PIN_HARNESS.NANO_D12, port DEV_PIN_HARNESS.DEV_IO16  [project net D12]
GPIO37: U16.42(GPIO37) ; port ESP_GPIO37, port NANO_PIN_HARNESS.NANO_AREF, port DEV_PIN_HARNESS.DEV_IO17  [project net AREF]
GPIO39: U16.44(MTCK) ; port ESP_GPIO39, port DEV_PIN_HARNESS.DEV_IO18
GPIO40: U16.45(MTDO) ; port ESP_GPIO40, port DEV_PIN_HARNESS.DEV_IO19
GPIO41: U16.47(MTDI) ; port ESP_GPIO41, port DEV_PIN_HARNESS.DEV_IO21
GPIO42: U16.48(MTMS) ; port ESP_GPIO42, port STM32_CONTROL, port DEV_PIN_HARNESS.DEV_IO22
GPIO45: U16.51(GPIO45) ; port ESP_GPIO45, port STM32_Rx, port DEV_PIN_HARNESS.DEV_IO23
GPIO46: U16.52(GPIO46) ; port ESP_GPIO46, port STM32_Tx
GPIO47: U16.37(SPICLK_P) ; port ESP_GPIO47, port ESP_DEV_BOOT  [project net DEV_BOOT]
GPIO48: U16.36(SPICLK_N) ; port ESP_GPIO48, port DEV_PIN_HARNESS.DEV_RESET  [project net DEV_RESET]
LNA_IN: C57.2 L2.2 U16.1(LNA_IN)  [project net LNA_IN_6]
SPI_CLK: U16.33(SPICLK) U22.6(CLK)  [project net SPI_CLK_6]
SPI_CS0: U16.32(SPICS0) U22.1(NCS)  [project net SPI_CS0_6]
SPI_D: U16.35(SPID) U22.5(DI_(IO0))  [project net SPI_D_6]
SPI_HD: U16.30(SPIHD) U22.7(NHOLD_(IO3))  [project net SPI_HD_6]
SPI_Q: U16.34(SPIQ) U22.2(DO_(IO1))  [project net SPI_Q_6]
SPI_WP: U16.31(SPIWP) U22.3(NWP_(IO2))  [project net SPI_WP_6]
VDD_SPI: C66.2 C67.2 TP4.1(TP) U16.29(VDD_SPI)  [project net VDD_SPI_6]
XTAL_N: R37.2 U16.53(XTAL_N)  [project net XTAL_N_6]
XTAL_P: L3.1 U16.54(XTAL_P)  [project net XTAL_P_6]
NetANT1_1: ANT1.1(RF) C54.2 L1.1

Not connected (* = marked no-connect by the designer): U16 21(XTAL_32K_P)* 22(XTAL_32K_N)*

### Notes on the sheet
- Z=50R
- Impedance matching
- Z=(35+j10)R
- CHIP Impedance match
- ADC Channel 1 pins are:
  IO1-IO10
  ADC Channel 2 pins are:
  IO11-IO20
- RESET
- BOOT

### Library data of the parts
ANT1 = ANT_IFA_USB_2_4GHZ_50R: Inverted F 2.4GHz ISM PCB Antenna 50 Ohm; ComponentLink1Description: Datasheet; ComponentLink1URL: https://www.ti.com/lit/an/swra117d/swra117d.pdf
C54-C72 = CAP_0603: Capacitor SMD 0603; Manufacturer: *; Manufacturer Part Number: *; Distributor Link: *; LCSC: *; Rating: *; Dielectric: *
L1-L4 = IND_0603: Inductor SMD 0603
R37-R39 = RES_0603: Resistor SMD 0603; Manufacturer: *; Manufacturer Part Number: *; Distributor Link: *; LCSC: *
SW4 SW5 = CMP-2100-03586-2: as SW2 on sheet RP2040 MCU; Height: 1.2mm; Width: 3mm; Weight: 0.000776oz; Contact Material: Silver; Max Voltage Rating (DC): 12V; Insulation Resistance: 100MR; Lead Free: Lead Free; Current Rating: 50mA; Termination: SMD/SMT; Length: 4mm; Voltage Rating (DC): 12V; Contact Current Rating: 50mA; Orientation: Straight; Depth: 2.5mm; Max Operating Temperature: 70°C; Packaging: Tape and Reel; Min Operating Temperature: -25°C; Package Quantity: 1; Mount: Surface Mount; Electrical Life: 200000Cycles
TP3 TP4 = TEST_POINT_RND_1MM: Test Point Round 1mm (NO BOM)
U16 = ESP32-S3FN8: No Description Available; Manufacturer_Name: Espressif Systems; Copyright: Copyright (C) 2025 Ultra Librarian. All rights reserved.; Manufacturer_Part_Number: ESP32-S3FN8; RefDes: RefDes; Type: Type
U22 = W25Q128JVSIM: as U14 on sheet RP2040 MCU; Manufacturer Part Number: W25Q128JVSIM
X2 = TSX-3225_24.0000MF15X-AC: as X1 on sheet RP2040 MCU